# EAGLE design switch_board (EAGLE 7.4.0)
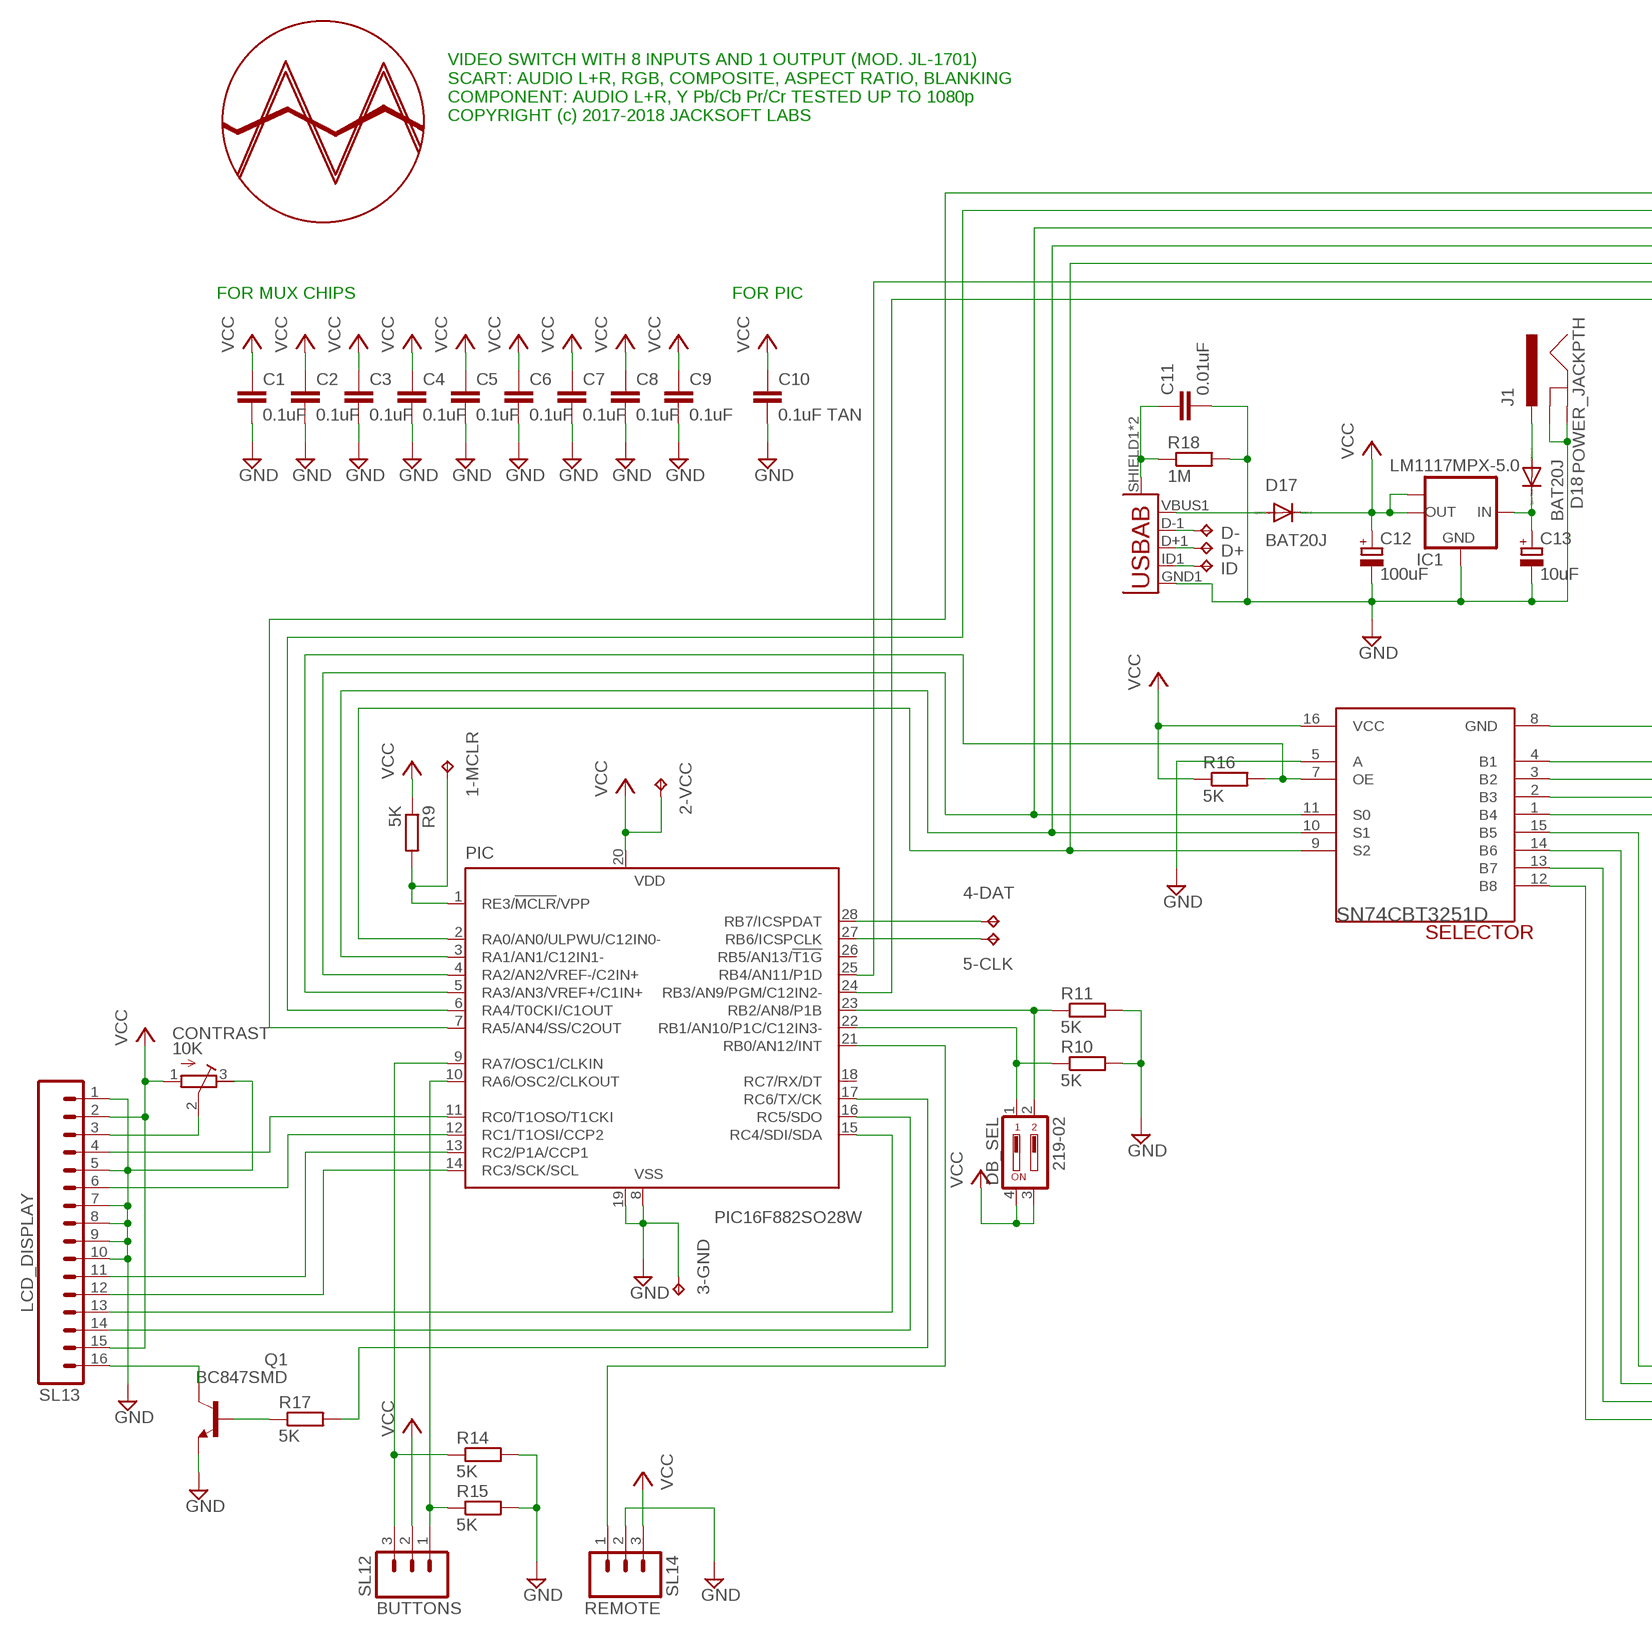
[diagram p0: schematic, sheet 1, part 1 of 2]
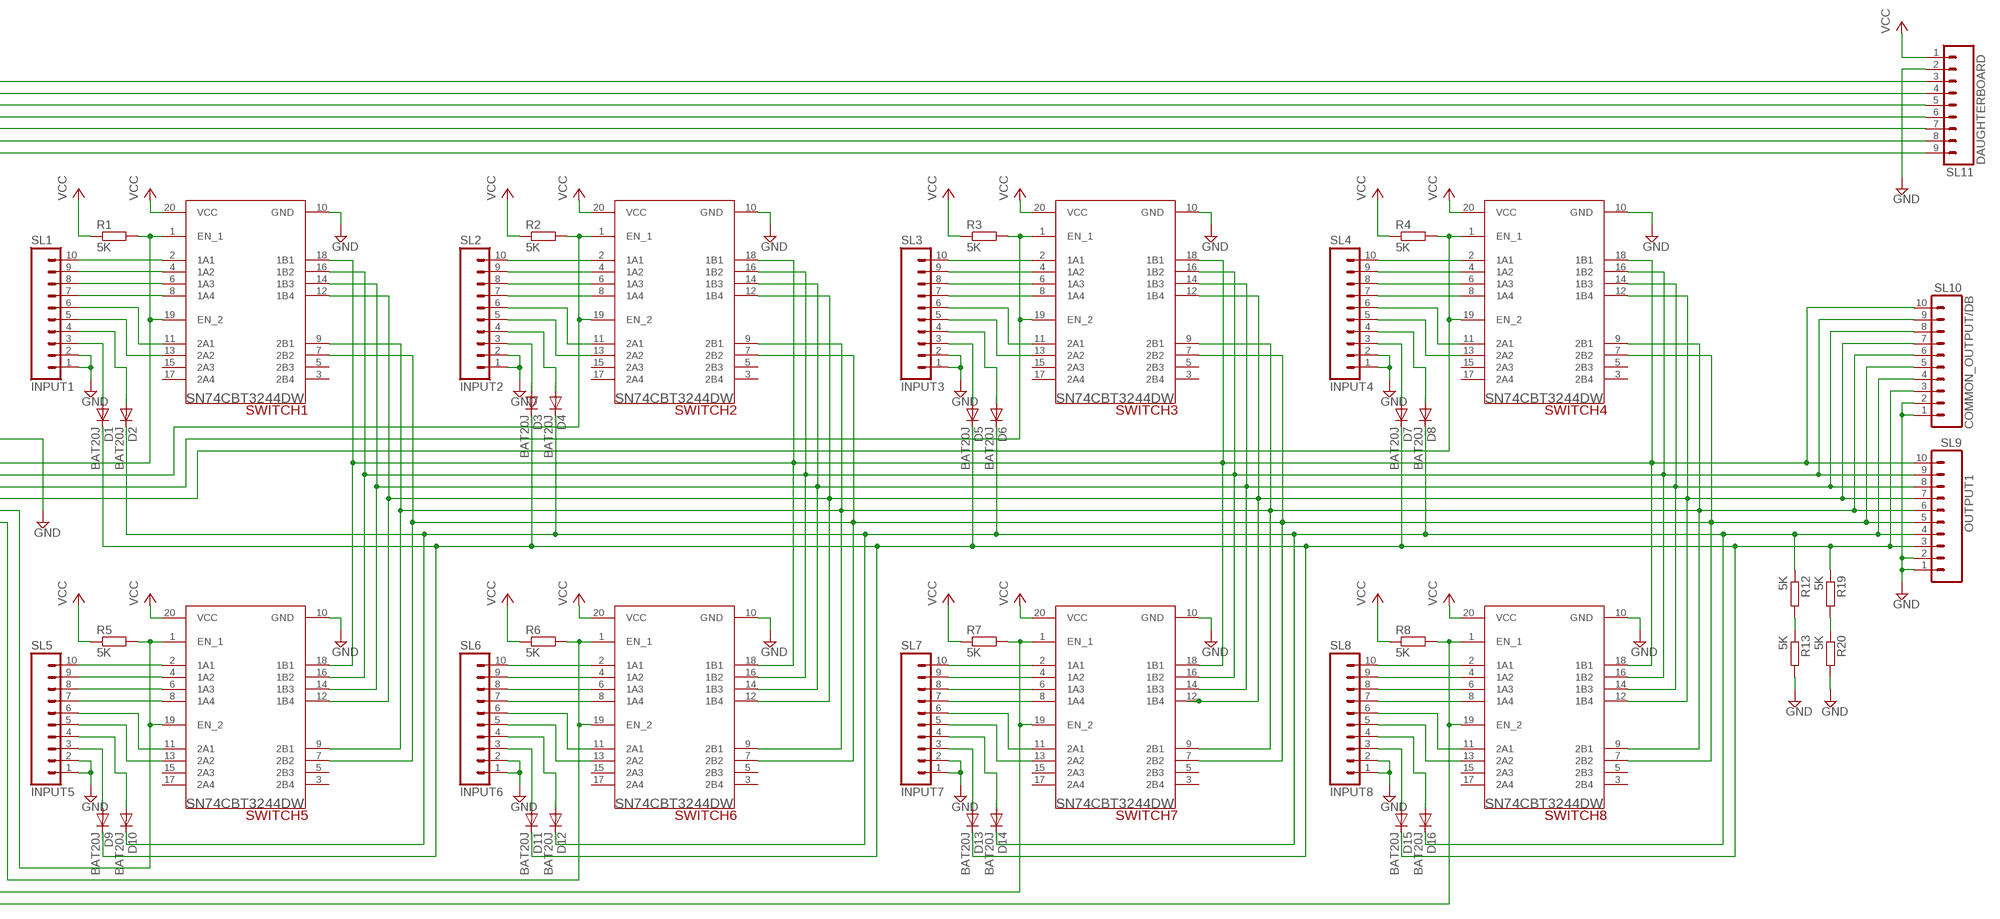
[diagram p1: schematic, sheet 1, part 2 of 2]

## Parts
1-MCLR  TPB1,27  [B1,27]
2-VCC  TPB1,27  [B1,27]
3-GND  TPB1,27  [B1,27]
4-DAT  TPB1,27  [B1,27]
5-CLK  TPB1,27  [B1,27]
C1  0.1uF  C-EUC0603  [C0603]
C2  0.1uF  C-EUC0603  [C0603]
C3  0.1uF  C-EUC0603  [C0603]
C4  0.1uF  C-EUC0603  [C0603]
C5  0.1uF  C-EUC0603  [C0603]
C6  0.1uF  C-EUC0603  [C0603]
C7  0.1uF  C-EUC0603  [C0603]
C8  0.1uF  C-EUC0603  [C0603]
C9  0.1uF  C-EUC0603  [C0603]
C10  0.1uF TAN  C-EUC3216  [C3216]
C11  0.01uF  C-EUC0603  [C0603]
C12  100uF  CPOL-EU153CLV-0405  [153CLV-0405]
C13  10uF  CPOL-EU153CLV-0405  [153CLV-0405]
CONTRAST  10K  R-TRIMM3304W  [RTRIM3304W]
D1  BAT20J  DIODE-SOD323-W  [SOD323-W]
D2  BAT20J  DIODE-SOD323-W  [SOD323-W]
D3  BAT20J  DIODE-SOD323-W  [SOD323-W]
D4  BAT20J  DIODE-SOD323-W  [SOD323-W]
D5  BAT20J  DIODE-SOD323-W  [SOD323-W]
D6  BAT20J  DIODE-SOD323-W  [SOD323-W]
D7  BAT20J  DIODE-SOD323-W  [SOD323-W]
D8  BAT20J  DIODE-SOD323-W  [SOD323-W]
D9  BAT20J  DIODE-SOD323-W  [SOD323-W]
D10  BAT20J  DIODE-SOD323-W  [SOD323-W]
D11  BAT20J  DIODE-SOD323-W  [SOD323-W]
D12  BAT20J  DIODE-SOD323-W  [SOD323-W]
D13  BAT20J  DIODE-SOD323-W  [SOD323-W]
D14  BAT20J  DIODE-SOD323-W  [SOD323-W]
D15  BAT20J  DIODE-SOD323-W  [SOD323-W]
D16  BAT20J  DIODE-SOD323-W  [SOD323-W]
D17  BAT20J  DIODE-SOD323-W  [SOD323-W]
D18  BAT20J  DIODE-SOD323-W  [SOD323-W]
D+  TPTP06R  [TP06R]
D-  TPTP06R  [TP06R]
DB_SEL  219-02  [CTS-219-02]
IC1  LM1117MPX-5.0  [SOT223]
ID  TPTP06R  [TP06R]
J1  POWER_JACKPTH  [POWER_JACK_PTH]
PIC  PIC16F882SO28W  [16F882]
Q1  BC847SMD  [SOT23]
R1  5K  R-EU_R0603  [R0603]
R2  5K  R-EU_R0603  [R0603]
R3  5K  R-EU_R0603  [R0603]
R4  5K  R-EU_R0603  [R0603]
R5  5K  R-EU_R0603  [R0603]
R6  5K  R-EU_R0603  [R0603]
R7  5K  R-EU_R0603  [R0603]
R8  5K  R-EU_R0603  [R0603]
R9  5K  R-EU_R0603  [R0603]
R10  5K  R-EU_R0603  [R0603]
R11  5K  R-EU_R0603  [R0603]
R12  5K  R-EU_R0603  [R0603]
R13  5K  R-EU_R0603  [R0603]
R14  5K  R-EU_R0603  [R0603]
R15  5K  R-EU_R0603  [R0603]
R16  5K  R-EU_R0603  [R0603]
R17  5K  R-EU_R0603  [R0603]
R18  1M  R-EU_R0603  [R0603]
R19  5K  R-EU_R0603  [R0603]
R20  5K  R-EU_R0603  [R0603]
SELECTOR  SN74CBT3251D  [SOIC127P1032X265-16N]
SL1  INPUT1  M10  [10P]
SL2  INPUT2  M10  [10P]
SL3  INPUT3  M10  [10P]
SL4  INPUT4  M10  [10P]
SL5  INPUT5  M10  [10P]
SL6  INPUT6  M10  [10P]
SL7  INPUT7  M10  [10P]
SL8  INPUT8  M10  [10P]
SL9  OUTPUT1  M10  [10P]
SL10  COMMON_OUTPUT/DB  M10  [10P]
SL11  DAUGHTERBOARD  M09  [09P]
SL12  BUTTONS  M03  [03P]
SL13  LCD_DISPLAY  M16  [16P]
SL14  REMOTE  M03  [03P]
SWITCH1  SN74CBT3244DW  [SOIC127P1032X265-20N]
SWITCH2  SN74CBT3244DW  [SOIC127P1032X265-20N]
SWITCH3  SN74CBT3244DW  [SOIC127P1032X265-20N]
SWITCH4  SN74CBT3244DW  [SOIC127P1032X265-20N]
SWITCH5  SN74CBT3244DW  [SOIC127P1032X265-20N]
SWITCH6  SN74CBT3244DW  [SOIC127P1032X265-20N]
SWITCH7  SN74CBT3244DW  [SOIC127P1032X265-20N]
SWITCH8  SN74CBT3244DW  [SOIC127P1032X265-20N]
U$1  JACKSOFTLABS-LOGOLONGTEXT  [LOGO-LONGTEXT]
USB  USB_POWER  MICROUSB""  [USB-MICRO-SMD]

## Nets
GND: 3-GND.TP C1.2 C2.2 C3.2 C4.2 C5.2 C6.2 C7.2 C8.2 C9.2 C10.2 C11.2 C12.- C13.- CONTRAST.3(E) IC1.1(GND) J1.GND J1.GNDBREAK PIC.8(VSS) PIC.19(VSS) Q1.2(E) R10.2 R11.2 R13.2 R14.2 R15.2 R18.2 R20.2 SELECTOR.5(A) SELECTOR.8(GND) SL1.1 SL1.2 SL2.1 SL2.2 SL3.1 SL3.2 SL4.1 SL4.2 SL5.1 SL5.2 SL6.1 SL6.2 SL7.1 SL7.2 SL8.1 SL8.2 SL9.1 SL9.2 SL10.1 SL10.2 SL11.2 SL13.1 SL13.5 SL13.7 SL13.8 SL13.9 SL13.10 SL14.2 SWITCH1.10(GND) SWITCH2.10(GND) SWITCH3.10(GND) SWITCH4.10(GND) SWITCH5.10(GND) SWITCH6.10(GND) SWITCH7.10(GND) SWITCH8.10(GND) USB.GND1(GND)
N$1: SL1.10 SWITCH1.2(1A1)
N$2: SL1.9 SWITCH1.4(1A2)
N$3: SL1.8 SWITCH1.6(1A3)
N$4: SL1.7 SWITCH1.8(1A4)
N$5: SL1.6 SWITCH1.11(2A1)
N$6: SL1.5 SWITCH1.13(2A2)
N$7: D2.A SL1.4
N$8: D1.A SL1.3
N$9: R1.2 SELECTOR.4(B1) SWITCH1.1(EN_1) SWITCH1.19(EN_2)
N$10: SL2.10 SWITCH2.2(1A1)
N$11: SL2.9 SWITCH2.4(1A2)
N$12: SL2.8 SWITCH2.6(1A3)
N$13: SL2.7 SWITCH2.8(1A4)
N$14: SL2.6 SWITCH2.11(2A1)
N$15: SL2.5 SWITCH2.13(2A2)
N$16: D4.A SL2.4
N$17: D3.A SL2.3
N$18: R2.2 SELECTOR.3(B2) SWITCH2.1(EN_1) SWITCH2.19(EN_2)
N$19: SL3.10 SWITCH3.2(1A1)
N$20: SL3.9 SWITCH3.4(1A2)
N$21: SL3.8 SWITCH3.6(1A3)
N$22: SL3.7 SWITCH3.8(1A4)
N$23: SL3.6 SWITCH3.11(2A1)
N$24: SL3.5 SWITCH3.13(2A2)
N$25: D6.A SL3.4
N$26: D5.A SL3.3
N$27: R3.2 SELECTOR.2(B3) SWITCH3.1(EN_1) SWITCH3.19(EN_2)
N$28: SL4.10 SWITCH4.2(1A1)
N$29: SL4.9 SWITCH4.4(1A2)
N$30: SL4.8 SWITCH4.6(1A3)
N$31: SL4.7 SWITCH4.8(1A4)
N$32: SL4.6 SWITCH4.11(2A1)
N$33: SL4.5 SWITCH4.13(2A2)
N$34: D8.A SL4.4
N$35: D7.A SL4.3
N$36: R4.2 SELECTOR.1(B4) SWITCH4.1(EN_1) SWITCH4.19(EN_2)
N$37: SL9.10 SL10.10 SWITCH1.18(1B1) SWITCH2.18(1B1) SWITCH3.18(1B1) SWITCH4.18(1B1) SWITCH5.18(1B1) SWITCH6.18(1B1) SWITCH7.18(1B1) SWITCH8.18(1B1)
N$38: SL9.9 SL10.9 SWITCH1.16(1B2) SWITCH2.16(1B2) SWITCH3.16(1B2) SWITCH4.16(1B2) SWITCH5.16(1B2) SWITCH6.16(1B2) SWITCH7.16(1B2) SWITCH8.16(1B2)
N$39: PIC.11(RC0/T1OSO/T1CKI) SL13.4
N$40: PIC.12(RC1/T1OSI/CCP2) SL13.6
N$41: PIC.13(RC2/P1A/CCP1) SL13.11
N$42: DB_SEL.1 PIC.22(RB1/AN10/P1C/C12IN3-) R10.1
N$43: PIC.14(RC3/SCK/SCL) SL13.12
N$44: CONTRAST.2(S) SL13.3
N$45: SL5.10 SWITCH5.2(1A1)
N$46: SL5.9 SWITCH5.4(1A2)
N$47: SL5.8 SWITCH5.6(1A3)
N$48: SL5.7 SWITCH5.8(1A4)
N$49: SL5.6 SWITCH5.11(2A1)
N$50: SL5.5 SWITCH5.13(2A2)
N$51: D10.A SL5.4
N$52: D9.A SL5.3
N$53: R5.2 SELECTOR.15(B5) SWITCH5.1(EN_1) SWITCH5.19(EN_2)
N$54: SL6.10 SWITCH6.2(1A1)
N$55: SL6.9 SWITCH6.4(1A2)
N$56: SL6.8 SWITCH6.6(1A3)
N$57: SL6.7 SWITCH6.8(1A4)
N$58: SL6.6 SWITCH6.11(2A1)
N$59: SL6.5 SWITCH6.13(2A2)
N$60: D12.A SL6.4
N$61: D11.A SL6.3
N$62: R6.2 SELECTOR.14(B6) SWITCH6.1(EN_1) SWITCH6.19(EN_2)
N$63: SL7.10 SWITCH7.2(1A1)
N$64: SL7.9 SWITCH7.4(1A2)
N$65: SL7.8 SWITCH7.6(1A3)
N$66: SL7.7 SWITCH7.8(1A4)
N$67: SL7.6 SWITCH7.11(2A1)
N$68: SL7.5 SWITCH7.13(2A2)
N$69: D14.A SL7.4
N$70: D13.A SL7.3
N$71: R7.2 SELECTOR.13(B7) SWITCH7.1(EN_1) SWITCH7.19(EN_2)
N$72: SL8.10 SWITCH8.2(1A1)
N$73: SL8.9 SWITCH8.4(1A2)
N$74: SL8.8 SWITCH8.6(1A3)
N$75: SL8.7 SWITCH8.8(1A4)
N$76: SL8.6 SWITCH8.11(2A1)
N$77: SL8.5 SWITCH8.13(2A2)
N$78: D16.A SL8.4
N$79: D15.A SL8.3
N$80: R8.2 SELECTOR.12(B8) SWITCH8.1(EN_1) SWITCH8.19(EN_2)
N$81: DB_SEL.2 PIC.23(RB2/AN8/P1B) R11.1
N$82: 1-MCLR.TP PIC.1(RE3/!MCLR!/VPP) R9.2
N$83: PIC.5(RA3/AN3/VREF+/C1IN+) R16.2 SELECTOR.7(OE)
N$84: C11.1 R18.1 USB.SHIELD1(SHIELD) USB.SHIELD2(SHIELD)
N$85: PIC.4(RA2/AN2/VREF-/C2IN+) SELECTOR.11(S0) SL11.5
N$86: PIC.3(RA1/AN1/C12IN1-) SELECTOR.10(S1) SL11.6
N$87: PIC.2(RA0/AN0/ULPWU/C12IN0-) SELECTOR.9(S2) SL11.7
N$88: PIC.6(RA4/T0CKI/C1OUT) SL11.4
N$89: 4-DAT.TP PIC.28(RB7/ICSPDAT)
N$90: 5-CLK.TP PIC.27(RB6/ICSPCLK)
N$91: PIC.7(RA5/AN4/SS/C2OUT) SL11.3
N$92: Q1.3(C) SL13.16
N$93: Q1.1(B) R17.1
N$94: D17.A USB.VBUS1(VBUS)
N$95: PIC.21(RB0/AN12/INT) SL14.1
N$96: PIC.15(RC4/SDI/SDA) SL13.13
N$97: PIC.16(RC5/SDO) SL13.14
N$98: PIC.17(RC6/TX/CK) R17.2
N$99: C13.+ D18.C IC1.3(IN)
N$100: PIC.10(RA6/OSC2/CLKOUT) R15.1 SL12.1
N$101: PIC.9(RA7/OSC1/CLKIN) R14.1 SL12.3
N$102: D1.C D3.C D5.C D7.C D9.C D11.C D13.C D15.C R19.1 SL9.3 SL10.3
N$103: D2.C D4.C D6.C D8.C D10.C D12.C D14.C D16.C R12.1 SL9.4 SL10.4
N$104: SL9.5 SL10.5 SWITCH1.7(2B2) SWITCH2.7(2B2) SWITCH3.7(2B2) SWITCH4.7(2B2) SWITCH5.7(2B2) SWITCH6.7(2B2) SWITCH7.7(2B2) SWITCH8.7(2B2)
N$105: SL9.6 SL10.6 SWITCH1.9(2B1) SWITCH2.9(2B1) SWITCH3.9(2B1) SWITCH4.9(2B1) SWITCH5.9(2B1) SWITCH6.9(2B1) SWITCH7.9(2B1) SWITCH8.9(2B1)
N$106: SL9.7 SL10.7 SWITCH1.12(1B4) SWITCH2.12(1B4) SWITCH3.12(1B4) SWITCH4.12(1B4) SWITCH5.12(1B4) SWITCH6.12(1B4) SWITCH7.12(1B4) SWITCH8.12(1B4)
N$107: SL9.8 SL10.8 SWITCH1.14(1B3) SWITCH2.14(1B3) SWITCH3.14(1B3) SWITCH4.14(1B3) SWITCH5.14(1B3) SWITCH6.14(1B3) SWITCH7.14(1B3) SWITCH8.14(1B3)
N$108: D18.A J1.PWR
N$109: D-.TP USB.D-1(D-)
N$110: D+.TP USB.D+1(D+)
N$111: ID.TP USB.ID1(USBID)
N$112: R12.2 R13.1
N$113: R19.2 R20.1
N$116: PIC.25(RB4/AN11/P1D) SL11.8
N$117: PIC.24(RB3/AN9/PGM/C12IN2-) SL11.9
VCC: 2-VCC.TP C1.1 C2.1 C3.1 C4.1 C5.1 C6.1 C7.1 C8.1 C9.1 C10.1 C12.+ CONTRAST.1(A) D17.C DB_SEL.3 DB_SEL.4 IC1.2(OUT) IC1.TAB(OUT1) PIC.20(VDD) R1.1 R2.1 R3.1 R4.1 R5.1 R6.1 R7.1 R8.1 R9.1 R16.1 SELECTOR.16(VCC) SL11.1 SL12.2 SL13.2 SL13.15 SL14.3 SWITCH1.20(VCC) SWITCH2.20(VCC) SWITCH3.20(VCC) SWITCH4.20(VCC) SWITCH5.20(VCC) SWITCH6.20(VCC) SWITCH7.20(VCC) SWITCH8.20(VCC)
Unconnected: PIC.18(RC7/RX/DT) PIC.26(RB5/AN13/!T1G) SWITCH1.3(2B4) SWITCH1.5(2B3) SWITCH1.15(2A3) SWITCH1.17(2A4) SWITCH2.3(2B4) SWITCH2.5(2B3) SWITCH2.15(2A3) SWITCH2.17(2A4) SWITCH3.3(2B4) SWITCH3.5(2B3) SWITCH3.15(2A3) SWITCH3.17(2A4) SWITCH4.3(2B4) SWITCH4.5(2B3) SWITCH4.15(2A3) SWITCH4.17(2A4) SWITCH5.3(2B4) SWITCH5.5(2B3) SWITCH5.15(2A3) SWITCH5.17(2A4) SWITCH6.3(2B4) SWITCH6.5(2B3) SWITCH6.15(2A3) SWITCH6.17(2A4) SWITCH7.3(2B4) SWITCH7.5(2B3) SWITCH7.15(2A3) SWITCH7.17(2A4) SWITCH8.3(2B4) SWITCH8.5(2B3) SWITCH8.15(2A3) SWITCH8.17(2A4)

## Notes on the sheet
- VIDEO SWITCH WITH 8 INPUTS AND 1 OUTPUT (MOD. JL-1701)
  SCART: AUDIO L+R, RGB, COMPOSITE, ASPECT RATIO, BLANKING
  COMPONENT: AUDIO L+R, Y Pb/Cb Pr/Cr TESTED UP TO 1080p
  COPYRIGHT (c) 2017-2018 JACKSOFT LABS
- FOR MUX CHIPS | FOR PIC

## Library data of the parts
1-MCLR 2-VCC 3-GND 4-DAT 5-CLK D+ D- ID = testpad:TP: Test pad
C1-C11 = resistor:C-EU: CAPACITOR, European symbol
C12 C13 = resistor:CPOL-EU: POLARIZED CAPACITOR, European symbol
CONTRAST = resistor:R-TRIMM: Trimm resistor
D1-D18 = diode:DIODE-: DIODE
DB_SEL = switch-dil:219-02*: Surface Mount DIP Switch Series 219 SMT CTS Electronic Components Sourc: www.ctscorp.com; OC_FARNELL: unknown; OC_NEWARK: unknown
IC1 = lm1117:LM1117MPX-*
J1 = SparkFun-Connectors:POWER_JACK: Power Jack This is the standard 5.5mm barrel jack for power. The PTH is the most common, proven, reliable, footprint. The Slot footprint only works if the mill layer is transmitted to the PCB fab house so be warned. Mating wall wart : TOL-00298 (and others); PROD_ID: CONN-08197
PIC = PIC16F882:PIC16F882: PIC16F882
Q1 = transistor-npn:BC847*: NPN Transistor
R1-R20 = resistor:R-EU_: RESISTOR, European symbol
SELECTOR = brendan-stuff-mod:SN74CBT3251D: SN74CBT3251D 1-of-8 FET Multiplexer and Demultiplexer, SOIC16 package.
SL1-SL10 = con-amp-quick:M10: AMP QUICK CONNECTOR; OC_FARNELL: unknown; OC_NEWARK: unknown
SL11 = con-amp-quick:M09: AMP QUICK CONNECTOR; OC_FARNELL: unknown; OC_NEWARK: unknown
SL12 SL14 = con-amp-quick:M03: AMP QUICK CONNECTOR; OC_FARNELL: unknown; OC_NEWARK: unknown
SL13 = con-amp-quick:M16: AMP QUICK CONNECTOR; OC_FARNELL: unknown; OC_NEWARK: unknown
SWITCH1-SWITCH8 = brendan-stuff:SN74CBT3244DW: SN74CBT3244DW Octal FET bus switch, SOIC20 package.
U$1 = jl-logo:JACKSOFTLABS-LOGO: Jacksoft Labs logo (Text Place)
USB = microusbok:MICROUSB: This is a USB AB connector that is compatible with USB OTG. i.e. this connector can serve as a host or device

## Board
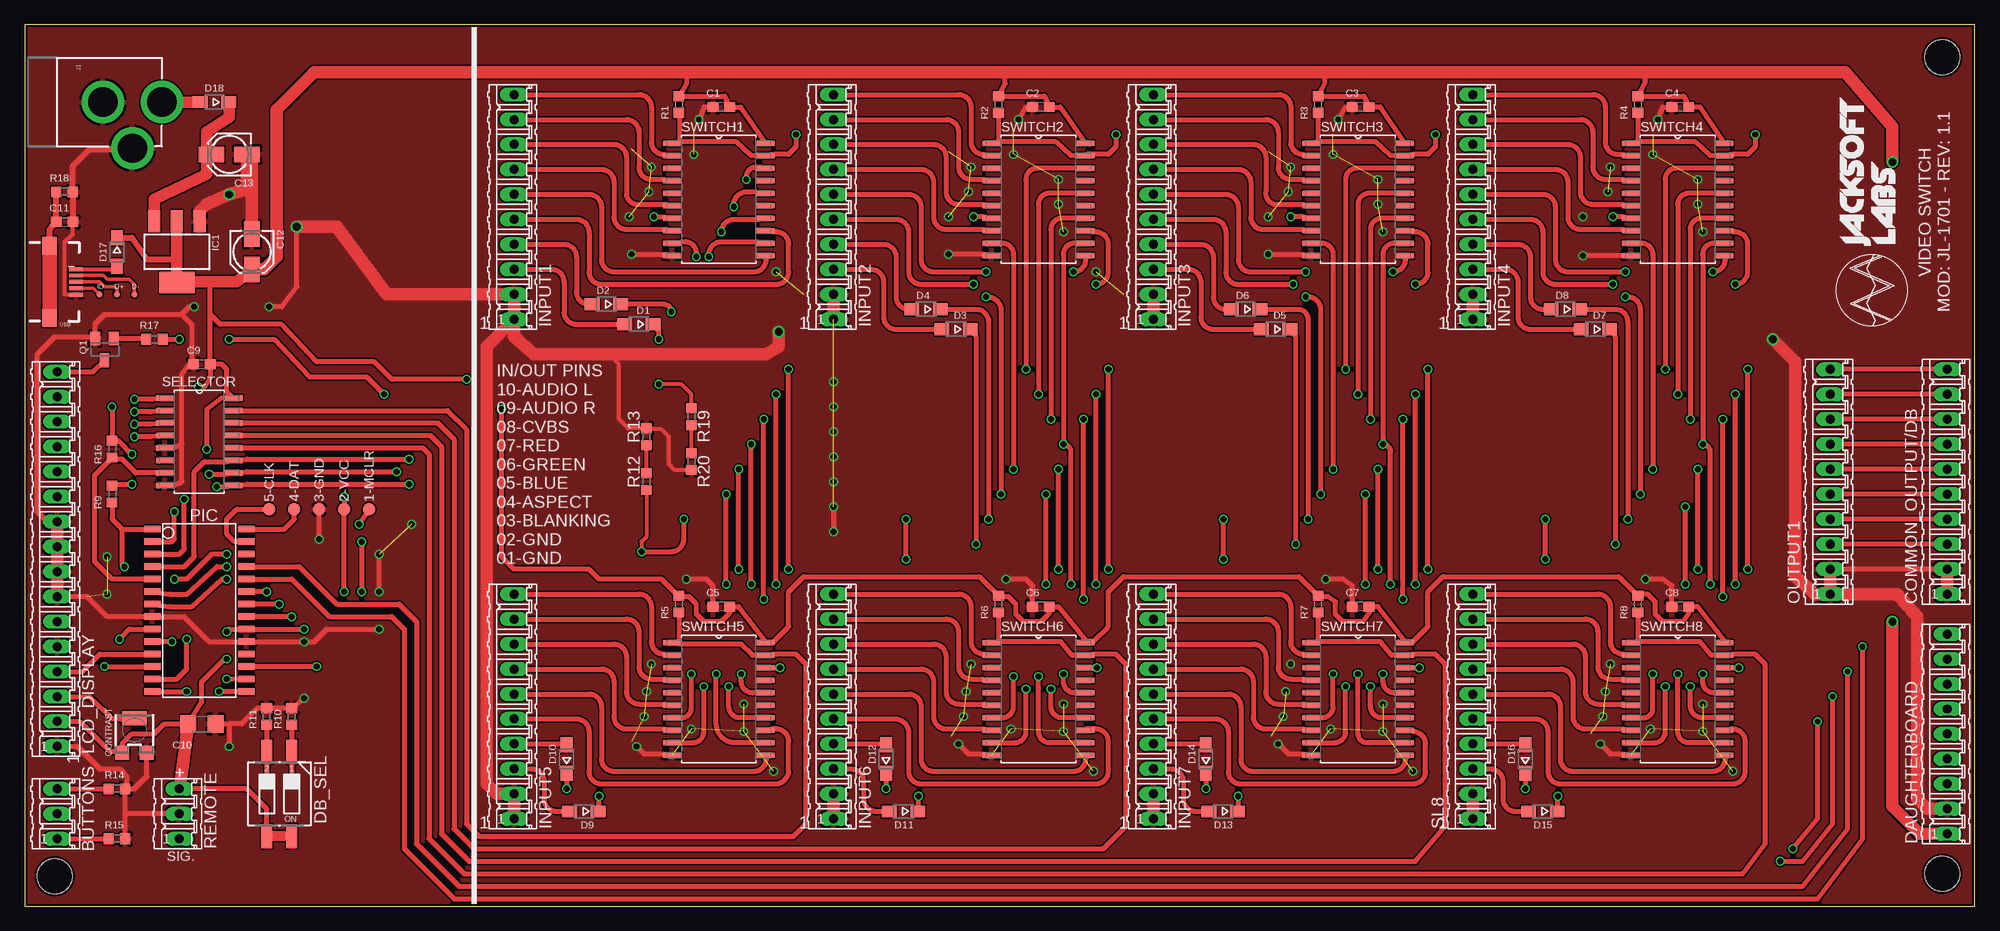
[diagram p2: board, top side]
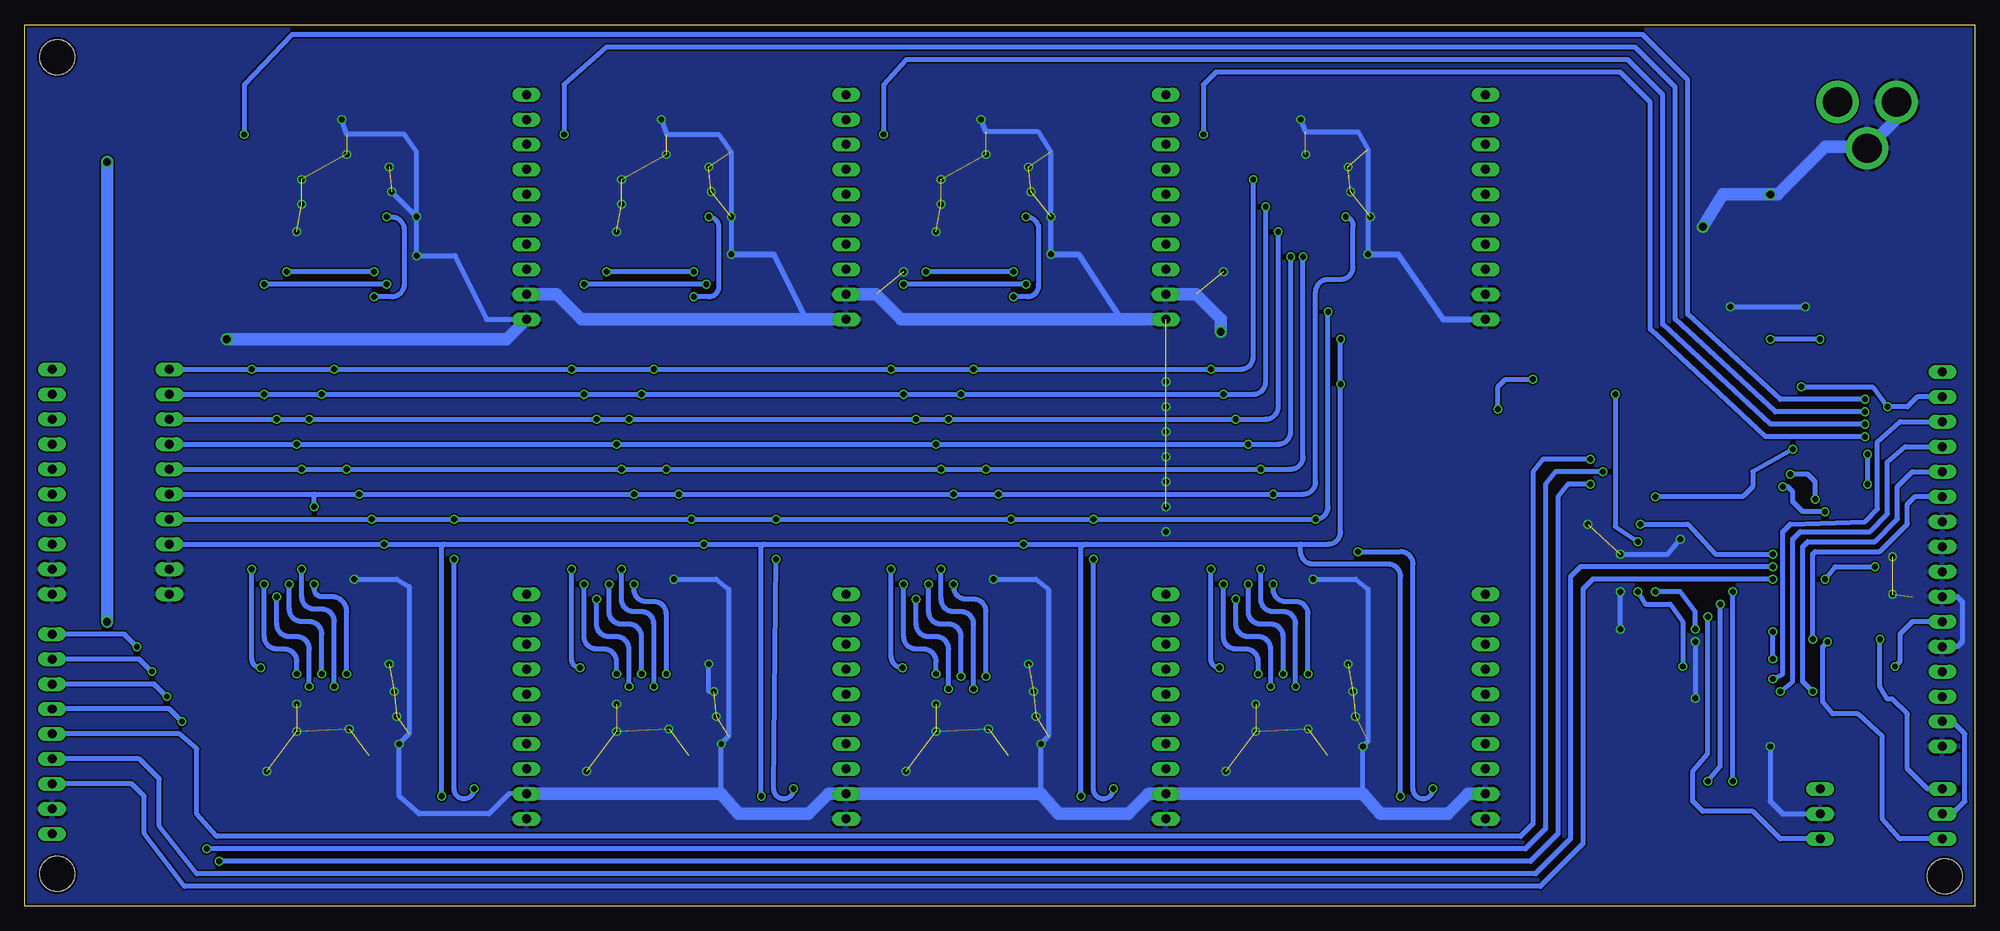
[diagram p3: board, bottom side, seen from below]

Size 198.37 x 89.66 mm. Coordinates in mm from the lower left corner, seen from the top.
Outline: 0,0 198.37,0 198.37,89.66 0,89.66 0,0
Copper layers (1*16): Top 0.035mm / dielectric 1.5mm / Bottom 0.035mm
Design rules "ITead_DRC": minimum track width 6mil, minimum drill 12mil, track to track 6mil, track to pad 6mil, pad to pad 6mil, via to via 6mil, smd to smd 0mil, copper to edge 10mil, drill to drill 10mil, minimum pad ring 10mil, minimum via ring 6mil, stop-mask expansion 2mil, vias tented up to drill 100mil, thermal gap 10mil
Holes 3.56 mm at 3.05,3.05 195.07,3.3 195.07,86.36

### Footprints (pad centres in the part's own frame; a part is rotated, then mirrored left to right if it is on the bottom)
B1,27 = smd 1.27 x 1.27: TP 0,0
C0603 = smd 1.1 x 1: 1 -0.85,0; 2 0.85,0
C3216 = smd 1.6 x 1.8: 1 -1.4,0; 2 1.4,0
153CLV-0405 = smd 2.6 x 1.6: + 1.8,0; - -1.8,0
RTRIM3304W = smd 1.4 x 1.4: 1 -1.25,-1.9; 3 1.25,-1.9 | smd 2.5 x 1.4: 2 0,1.6
SOD323-W = smd 1.5 x 1.2: A 1.45,0; C -1.45,0
TP06R = smd 0.6 x 0.6: TP 0,0
CTS-219-02 = smd 1.13 x 2.44: 1 -1.27,-4.3; 2 1.27,-4.3; 3 1.27,4.3; 4 -1.27,4.3
SOT223 = smd 1.219 x 2.235: 1 -2.311,-3.099; 2 0,-3.099; 3 2.311,-3.099 | smd 3.6 x 2.2: TAB 0,3.099
POWER_JACK_PTH = drill 2.997 pad 4.318: GND 0,7.7; GNDBREAK 4.7,10.7; PWR 0,13.7
16F882 = smd 0.65 x 1.7: 1 -8.89,-4.78; 2 -7.62,-4.78; 3 -6.35,-4.78; 4 -5.08,-4.78; 5 -3.81,-4.78; 6 -2.54,-4.78; 7 -1.27,-4.78; 8 0,-4.78; 9 1.27,-4.78; 10 2.54,-4.78; 11 3.81,-4.78; 12 5.08,-4.78; 13 6.35,-4.78; 14 7.62,-4.78; 15 7.62,4.78; 16 6.35,4.78; 17 5.08,4.78; 18 3.81,4.78; 19 2.54,4.78; 20 1.27,4.78; 21 0,4.78; 22 -1.27,4.78; 23 -2.54,4.78; 24 -3.81,4.78; 25 -5.08,4.78; 26 -6.35,4.78; 27 -7.62,4.78; 28 -8.89,4.78
SOT23 = smd 1 x 1.4: 1 -0.95,-1.1; 2 0.95,-1.1; 3 0,1.1
R0603 = smd 1 x 1.1: 1 -0.85,0; 2 0.85,0
SOIC127P1032X265-16N = smd 1.803 x 0.533: 1 -3.505,4.445; 2 -3.505,3.175; 3 -3.505,1.905; 4 -3.505,0.635; 5 -3.505,-0.635; 6 -3.505,-1.905; 7 -3.505,-3.175; 8 -3.505,-4.445; 9 3.505,-4.445; 10 3.505,-3.175; 11 3.505,-1.905; 12 3.505,-0.635; 13 3.505,0.635; 14 3.505,1.905; 15 3.505,3.175; 16 3.505,4.445
10P = drill 0.914 long: 1 -11.43,0; 2 -8.89,0; 3 -6.35,0; 4 -3.81,0; 5 -1.27,0; 6 1.27,0; 7 3.81,0; 8 6.35,0; 9 8.89,0; 10 11.43,0
09P = drill 0.914 long: 1 -10.16,0; 2 -7.62,0; 3 -5.08,0; 4 -2.54,0; 5 0,0; 6 2.54,0; 7 5.08,0; 8 7.62,0; 9 10.16,0
03P = drill 0.914 long: 1 -2.54,0; 2 0,0; 3 2.54,0
16P = drill 0.914 long: 1 -19.05,0; 2 -16.51,0; 3 -13.97,0; 4 -11.43,0; 5 -8.89,0; 6 -6.35,0; 7 -3.81,0; 8 -1.27,0; 9 1.27,0; 10 3.81,0; 11 6.35,0; 12 8.89,0; 13 11.43,0; 14 13.97,0; 15 16.51,0; 16 19.05,0
SOIC127P1032X265-20N = smd 1.803 x 0.533: 1 -4.775,5.715; 2 -4.775,4.445; 3 -4.775,3.175; 4 -4.775,1.905; 5 -4.775,0.635; 6 -4.775,-0.635; 7 -4.775,-1.905; 8 -4.775,-3.175; 9 -4.775,-4.445; 10 -4.775,-5.715; 11 4.775,-5.715; 12 4.775,-4.445; 13 4.775,-3.175; 14 4.775,-1.905; 15 4.775,-0.635; 16 4.775,0.635; 17 4.775,1.905; 18 4.775,3.175; 19 4.775,4.445; 20 4.775,5.715
USB-MICRO-SMD = smd 1.4 x 0.4: D+1 2.7,0; D-1 2.7,0.65; GND1 2.7,-1.3; ID1 2.7,-0.65; VBUS1 2.7,1.3 | smd 1.499 x 1.803: SHIELD1 0,3.683; SHIELD2 0,-3.683

### Placement (x,y rotation side)
1-MCLR  35.05,40.39 90 top
2-VCC  32.51,40.39 90 top
3-GND  29.97,40.39 0 top
4-DAT  27.43,40.39 0 top
5-CLK  24.89,40.39 0 top
C1  70.87,81.28 180 top
C2  103.38,81.28 180 top
C3  135.89,81.28 180 top
C4  168.4,81.28 180 top
C5  70.87,30.48 180 top
C6  103.38,30.48 180 top
C7  135.89,30.48 180 top
C8  168.4,30.48 180 top
C9  18.03,55.12 180 top
C10  18.03,18.54 0 top
C11  4.06,69.6 0 top
C12  23.11,66.55 270 top
C13  20.83,76.45 180 top
CONTRAST  11.18,17.53 0 top
D1  62.48,59.18 180 top
D2  59.18,61.21 180 top
D3  94.74,58.67 180 top
D4  91.69,60.71 180 top
D5  127.25,58.67 180 top
D6  124.21,60.71 180 top
D7  159.77,58.67 180 top
D8  156.72,60.71 180 top
D9  56.9,9.65 180 top
D10  55.12,14.99 90 top
D11  89.41,9.65 180 top
D12  87.63,14.99 90 top
D13  121.92,9.65 180 top
D14  120.14,14.99 90 top
D15  154.43,9.65 180 top
D16  152.65,14.99 90 top
D17  9.4,66.55 270 top
D18  19.3,81.79 180 top
D+  9.4,62.23 0 top
D-  11.18,62.23 0 top
DB_SEL  25.91,11.43 180 top
IC1  15.49,66.55 180 top
ID  7.62,62.23 0 top
J1  0.25,81.79 270 top
PIC  17.78,29.46 270 top
Q1  8.13,56.64 180 top
R1  66.55,81.53 270 top
R2  99.06,81.53 270 top
R3  131.57,81.53 270 top
R4  164.08,81.53 270 top
R5  66.55,30.73 270 top
R6  99.06,30.73 270 top
R7  131.57,30.73 270 top
R8  164.08,30.73 270 top
R9  8.89,41.91 270 top
R10  27.18,19.3 90 top
R11  24.64,19.3 90 top
R12  63.25,43.18 90 top
R13  63.25,47.75 90 top
R14  9.4,11.94 0 top
R15  9.4,6.86 0 top
R16  8.89,46.48 270 top
R17  13.21,57.66 0 top
R18  4.06,72.64 0 top
R19  67.82,49.78 270 top
R20  67.82,45.21 270 top
SELECTOR  17.78,47.24 0 top
SL1  49.78,71.12 90 top
SL2  82.3,71.12 90 top
SL3  114.81,71.12 90 top
SL4  147.32,71.12 90 top
SL5  49.78,20.32 90 top
SL6  82.3,20.32 90 top
SL7  114.81,20.32 90 top
SL8  147.32,20.32 90 top
SL9  183.64,43.18 90 top
SL10  195.58,43.18 90 top
SL11  195.58,17.53 90 top
SL12  3.3,9.4 90 top
SL13  3.3,35.31 90 top
SL14  15.75,9.4 90 top
SWITCH1  70.61,71.88 0 top
SWITCH2  103.12,71.88 0 top
SWITCH3  135.64,71.88 0 top
SWITCH4  168.15,71.88 0 top
SWITCH5  70.61,21.08 0 top
SWITCH6  103.12,21.08 0 top
SWITCH7  135.64,21.08 0 top
SWITCH8  168.15,21.08 0 top
U$1  187.71,62.23 90 top
USB  2.54,63.5 0 top

### Tracks (layer width: path | path; a pad name or v marks a point on that pad's centre or on a via)
GND  (via drill 0.6, 0.8)  (61 unrouted)
  Top 0.406: USB.GND1 4.06,62.2 4.06,67.56 4.91,68.33 C11.2 | R20.2 66.13,44.36 65.53,44.96 65.53,47.75 64.77,48.51 63.33,48.51 R13.2 61.38,48.6 60.45,49.53 60.45,55.12 59.44,56.13
  Top 0.508: SL10.2 SL9.2 | C1.2 69.09,81.28 v68.58,80.01 | v61.72,66.29 65.33,66.29 SWITCH1.10 | SWITCH2.10 98.3,66.17 97.54,66.29 v93.98,66.29 | v101.09,80.01 101.85,81.28 C2.2 | C3.2 134.37,81.28 v133.6,80.01 | v126.49,66.29 130.1,66.29 SWITCH3.10 | SWITCH4.10 v158.5,66.17 | v166.12,80.01 166.62,81.28 C4.2 | R15.2 10.25,9.4 | 10.25,9.4 R14.2 | SL13.1 5.33,16.26 7.62,13.97 9.65,13.97 10.41,13.21 10.41,12.1 R14.2 | R14.2 11.18,11.94 12.45,13.21 12.45,15.61 CONTRAST.3 | SL13.7 6.35,31.5 8.38,29.46 PIC.8 16.26,29.46 18.8,26.92 PIC.19 v28.45,26.92 29.46,26.92 30.73,28.19 v36.07,28.19 | SELECTOR.5 15.11,46.61 16,46.99 | 16,46.99 16,54.1 16.76,55.12 C9.2 17.02,55.21 17.02,59.18 16,60.2 | SL14.2 10.25,9.4 | 20.83,18.54 22.1,18.54 23.71,20.15 R11.2 R10.2 v28.45,21.17 | C10.2 20.83,18.54 | 20.83,18.54 v20.83,16.26 | 16,60.2 8.13,60.2 7.18,59.25 Q1.2 7.01,57.91 3.05,57.91 1.27,56.13 1.27,40.13 2.29,39.12 SL13.10 | SELECTOR.8 15.11,42.8 16,43.18 16,46.99 | C5.2 70.02,32.6 69.34,33.27 v67.31,33.27 | v62.23,16.26 62.99,15.49 64.95,15.49 SWITCH5.10 | C6.2 102.53,32.6 101.85,33.27 v99.82,33.27 | v95,16.51 96.01,15.49 97.46,15.49 SWITCH6.10 | C7.2 135.04,32.6 134.11,33.27 v132.33,33.27 | v127.51,16.51 128.52,15.49 129.97,15.49 SWITCH7.10 | C8.2 167.55,32.6 166.62,33.27 v164.85,33.27 | v160.27,16.51 161.29,15.49 162.48,15.49 SWITCH8.10 | v27.69,69.09 27.69,62.99 26.16,60.96 v24.89,60.96 | v17.27,60.96 16.76,60.96 16,60.2 | v36.07,32 v36.07,35.81 | v29.97,37.34 3-GND.TP | v82.3,40.64 v82.3,38.1
  Top 0.635: C11.2 R18.2 4.91,75.27 6.6,76.96 10.83,76.96 J1.GNDBREAK
  Top 1.27: SL1.1 SL1.2 36.83,62.23 31.75,69.09 v27.69,69.09 | SL10.1 SL10.2 | SL9.2 SL9.1 | SL2.2 SL2.1 | SL3.2 SL3.1 | SL4.2 SL4.1 | SL5.1 SL5.2 48.01,11.43 46.99,12.45 46.99,56.9 SL1.1 | SL6.2 SL6.1 | SL7.2 SL7.1 | SL8.2 SL8.1 | IC1.1 17.78,70.43 17.78,70.61 18.54,71.37 v20.83,72.39 22.63,72.92 C13.- 23.11,75.97 C12.- | v76.71,58.42 76.71,56.9 75.44,56.13 59.44,56.13 51.82,56.13 49.78,57.91 SL1.1 | SL13.7 SL13.8 SL13.9 SL13.10 | SL9.1 182.12,31.75 180.09,33.53 180.09,55.37 v177.8,57.66 | SL11.2 193.55,9.91 192.53,10.92 192.53,29.46 190.5,31.75 SL9.1
  Bottom 0.508: v68.58,80.01 68.07,78.74 62.74,78.74 61.72,76.96 v61.72,66.29 | v93.98,66.29 93.98,76.71 95.25,78.74 100.58,78.74 v101.09,80.01 | v133.6,80.01 133.1,78.49 127.76,78.49 126.49,76.71 v126.49,66.29 | v158.5,70.1 v158.5,66.17 154.56,66.17 151.38,59.69 SL4.1 | v158.5,70.1 158.5,76.71 159.77,78.49 165.61,78.49 v166.12,80.01 | SL13.7 1.78,31.5 1.27,30.99 1.27,26.92 1.78,26.42 SL13.5 | v20.83,16.26 20.83,10.67 19.56,9.4 SL14.2 | v67.31,33.27 62.99,33.27 61.72,32.26 61.72,16.76 v62.23,16.26 62.23,11.68 | v99.82,33.27 95.5,33.27 94.23,32.26 94.23,17.27 v95,16.51 95,11.43 | v132.33,33.27 128.02,33.27 126.75,32.26 126.75,17.27 v127.51,16.51 127.51,11.43 | v164.85,33.27 160.53,33.27 159.26,32.51 159.26,17.53 v160.27,16.51 160.27,11.18 158.24,9.4 151.13,9.4 149.1,11.43 SL8.2 | 62.23,11.43 62.23,11.68 | 62.48,11.43 62.23,11.68 | v24.89,60.96 v17.27,60.96 | v28.45,26.92 v28.45,21.17 | v36.07,28.19 v36.07,32 | v36.07,35.81 31.24,35.81 v29.97,37.34 | 11.08,77.22 J1.GNDBREAK | v128.27,21.84 128.78,21.84 v128.78,24.64 | v158.5,70.1 v161.04,72.64
  Bottom 0.635: v126.49,66.29 122.17,66.29 118.87,59.69 | v93.98,66.29 91.19,66.29 86.87,59.69 | v61.72,66.29 58.67,66.29 54.1,59.69 SL1.1
  Bottom 1.27: SL3.1 118.87,59.69 141.73,59.69 144.27,62.23 SL4.2 | SL2.1 86.87,59.69 109.22,59.69 111.76,62.23 SL3.2 | SL2.2 79.25,62.23 76.71,59.69 v76.71,58.42 | v27.69,69.09 25.65,72.39 v20.83,72.39 20.07,72.39 15.24,77.22 11.08,77.22 | SL8.2 127.51,11.43 125.73,9.4 118.62,9.4 116.59,11.43 SL7.2 95,11.43 93.22,9.4 86.11,9.4 84.07,11.43 SL6.2 62.48,11.43 | SL5.2 51.56,11.43 53.59,9.4 60.45,9.4 62.23,11.43 | v177.8,57.66 149.35,57.66 SL4.1 | J1.GND 7.95,80.09 J1.GNDBREAK
  other vias: 82.3,53.34 82.3,50.8 82.3,48.26 82.3,45.72 82.3,43.18 39.37,38.86 173.74,13.72 170.69,17.78 170.69,20.57 165.35,18.03 160.53,19.3 160.78,21.84 161.29,24.64 141.22,13.72 138.18,17.78 138.18,20.57 132.84,18.03 128.02,19.3 108.71,13.72 105.66,17.78 105.66,20.57 100.33,18.03 95.5,19.3 95.76,21.84 96.27,24.64 76.2,13.72 73.15,17.78 73.15,20.57 67.82,18.03 62.99,19.3 63.25,21.84 63.75,24.64 68.07,76.45 63.75,75.18 63.5,72.64 61.47,70.1 76.45,64.52 96.27,75.18 96.01,72.64 100.58,76.45 108.97,64.52 133.1,76.45 128.78,75.18 128.52,72.64 165.61,76.45 161.29,75.18 95.5,19.3 105.66,20.57 105.66,17.78 100.33,18.03 95.76,21.84 96.27,24.64 108.71,13.72 170.69,20.57 170.69,17.78 165.35,18.03 165.35,18.03 170.69,20.57 170.69,17.78 173.74,13.72 173.74,13.72 160.53,19.3 160.53,19.3 160.78,21.84 160.78,21.84 161.29,24.64 161.29,24.64 141.22,13.72 141.22,13.72 138.18,17.78 138.18,17.78 138.18,20.57 138.18,20.57 132.84,18.03 132.84,18.03 128.02,19.3 128.02,19.3 105.16,73.91 105.16,71.37 137.67,73.91 137.67,71.37 170.18,73.91 170.18,71.37 105.66,68.58 138.18,68.58 170.69,68.58 8.38,35.56 8.38,31.75 93.98,70.1 126.49,70.1
  pour Bottom: 0.25,89.41 198.12,89.41 198.12,0.25 0.25,0.25
  pour Top: 0.25,0.25 0.25,89.41 198.12,89.41 198.12,0.25
N$1
  Top 0.508: SL1.10 62.48,82.55 arc-90 63.75,81.28 63.75,77.72 arc90 65.02,76.45 65.08,76.45 SWITCH1.2
N$2
  Top 0.508: SL1.9 61.21,80.01 arc-90 62.48,78.74 62.48,75.18 arc90 63.75,73.91 65.08,73.91 SWITCH1.4
N$3
  Top 0.508: SL1.8 59.94,77.47 arc-90 61.21,76.2 61.21,72.39 arc90 62.48,71.37 65.33,71.37 SWITCH1.6
N$4
  Top 0.508: SL1.7 58.67,74.93 arc-90 59.94,73.66 59.94,70.1 arc90 61.21,68.83 65.33,68.83 SWITCH1.8
N$5
  Top 0.508: SL1.6 57.4,72.39 arc-90 58.67,71.12 58.67,65.79 arc90 59.94,64.52 74.17,64.52 arc90 75.44,65.79 75.44,66.12 arc90 SWITCH1.11
N$6
  Top 0.508: SL1.5 56.13,69.85 arc-90 57.4,68.58 57.4,64.52 arc90 58.67,63.25 76.45,63.25 arc90 77.72,64.52 77.72,67.31 arc90 76.45,68.58 76.2,68.58 75.44,68.71 SWITCH1.13
N$7
  Top 0.508: SL1.4 54.86,67.31 arc-90 56.13,66.04 56.13,62.48 arc90 57.4,61.21 D2.A
N$8
  Top 0.508: SL1.3 53.59,64.77 arc-90 54.86,63.5 54.86,60.45 arc90 56.13,59.18 D1.A
N$9  (via drill 0.6)
  Top 0.508: 66.6,77.72 72.39,77.72 73.91,76.33 SWITCH1.19 76.28,76.45 77.72,76.45 78.49,77.22 v78.49,78.49 | 66.6,77.72 SWITCH1.1 | R1.2 66.6,80.68 66.6,77.72 | SELECTOR.4 12.88,47.75 v11.18,47.75
  Bottom 0.508: v11.18,47.75 21.34,47.75 33.02,58.67 33.02,81.79 36.07,84.84 77.22,84.84 78.49,83.57 v78.49,78.49
N$10
  Top 0.508: SL2.10 95,82.55 arc-90 96.27,81.28 96.27,77.72 arc90 97.54,76.45 97.59,76.45 SWITCH2.2
N$11
  Top 0.508: SL2.9 93.73,80.01 arc-90 95,78.74 95,75.18 arc90 96.27,73.91 97.59,73.91 SWITCH2.4
N$12
  Top 0.508: SL2.8 92.46,77.47 arc-90 93.73,76.2 93.73,72.64 arc90 95,71.37 97.59,71.37 SWITCH2.6
N$13
  Top 0.508: SL2.7 91.19,74.93 arc-90 92.46,73.66 92.46,70.1 arc90 93.73,68.83 97.59,68.83 SWITCH2.8
N$14  (via drill 0.6)
  Top 0.508: SL2.6 89.92,72.39 arc-90 91.19,71.12 91.19,65.79 arc90 92.46,64.52 v97.79,64.52 | v106.68,64.52 arc90 107.95,65.79 107.95,66.12 arc90 SWITCH2.11
  Bottom 0.508: v97.79,64.52 v106.68,64.52
N$15  (via drill 0.6)
  Top 0.508: SL2.5 88.65,69.85 arc-90 89.92,68.58 89.92,64.52 arc90 91.19,63.25 v96.52,63.25 | v108.97,63.25 arc90 110.24,64.52 110.24,67.31 arc90 108.97,68.58 108.66,68.58 SWITCH2.13
  Bottom 0.508: v96.52,63.25 v108.97,63.25
N$16
  Top 0.508: SL2.4 87.38,67.31 arc-90 88.65,66.04 88.65,61.98 arc90 89.92,60.71 D4.A
N$17
  Top 0.508: SL2.3 86.11,64.77 arc-90 87.38,63.5 87.38,59.94 arc90 88.65,58.67 D3.A
N$18  (via drill 0.6)
  Top 0.508: R2.2 99.06,77.72 99.11,77.72 | 99.11,77.72 SWITCH2.1 | 99.11,77.72 104.9,77.72 106.43,76.33 SWITCH2.19 108.03,76.45 110.24,76.45 111,77.22 v111,78.49 | SELECTOR.3 12.88,49.02 v11.18,49.02
  Bottom 0.508: v11.18,49.02 20.83,49.02 31.75,59.18 31.75,82.55 35.31,86.11 108.71,86.11 111,83.57 v111,78.49
N$19
  Top 0.508: SL3.10 127.51,82.55 arc-90 128.78,81.28 128.78,77.72 arc90 130.05,76.45 130.1,76.45 SWITCH3.2
N$20
  Top 0.508: SL3.9 126.24,80.01 arc-90 127.51,78.74 127.51,75.18 arc90 128.78,73.91 130.1,73.91 SWITCH3.4
N$21
  Top 0.508: SL3.8 124.97,77.47 arc-90 126.24,76.2 126.24,72.64 arc90 127.25,71.37 130.1,71.37 SWITCH3.6
N$22
  Top 0.508: SL3.7 123.44,74.93 arc-90 124.71,73.66 124.71,70.1 arc90 125.98,68.83 130.1,68.83 SWITCH3.8
N$23  (via drill 0.6)
  Top 0.508: SL3.6 122.17,72.39 arc-90 123.44,71.12 123.44,65.79 arc90 124.71,64.52 v130.3,64.52 | v139.19,64.52 arc90 140.46,65.79 140.46,66.12 arc90 SWITCH3.11
  Bottom 0.508: v130.3,64.52 v139.19,64.52
N$24  (via drill 0.6)
  Top 0.508: SL3.5 120.9,69.85 arc-90 122.17,68.58 122.17,64.52 arc90 123.44,63.25 v129.03,63.25 | v141.48,63.25 arc90 142.75,64.52 142.75,67.31 arc90 141.48,68.58 141.17,68.58 SWITCH3.13
  Bottom 0.508: v129.03,63.25 v141.48,63.25
N$25
  Top 0.508: SL3.4 119.63,67.31 arc-90 120.9,66.04 120.9,61.98 arc90 122.17,60.71 D6.A
N$26
  Top 0.508: SL3.3 118.36,64.77 arc-90 119.63,63.5 119.63,59.94 arc90 120.9,58.67 D5.A
N$27  (via drill 0.6)
  Top 0.508: R3.2 131.57,77.72 131.62,77.72 | 131.62,77.72 137.41,77.72 138.94,76.33 SWITCH3.19 141.3,76.45 142.75,76.45 143.51,77.22 v143.51,78.49 | 131.62,77.72 SWITCH3.1 | SELECTOR.2 12.88,50.29 v11.18,50.29
  Bottom 0.508: v11.18,50.29 20.32,50.29 30.48,59.69 30.48,83.31 34.54,87.38 139.19,87.38 143.51,83.57 v143.51,78.49
N$28
  Top 0.508: SL4.10 159.51,82.55 arc-90 160.78,81.28 160.78,77.72 arc90 162.05,76.45 162.61,76.45 SWITCH4.2
N$29
  Top 0.508: SL4.9 158.24,80.01 arc-90 159.51,78.74 159.51,75.18 arc90 160.78,73.91 162.61,73.91 SWITCH4.4
N$30
  Top 0.508: SL4.8 156.97,77.47 arc-90 158.24,76.2 158.24,72.64 arc90 159.51,71.37 162.61,71.37 SWITCH4.6
N$31
  Top 0.508: SL4.7 155.7,74.93 arc-90 156.97,73.66 156.97,70.1 arc90 158.24,68.83 162.61,68.83 SWITCH4.8
N$32  (via drill 0.6)
  Top 0.508: SL4.6 154.43,72.39 arc-90 155.7,71.12 155.7,65.79 arc90 156.97,64.52 v162.81,64.52 | v171.7,64.52 arc90 172.97,65.79 172.97,65.99 SWITCH4.11
  Bottom 0.508: v162.81,64.52 v171.7,64.52
N$33  (via drill 0.6)
  Top 0.508: SL4.5 153.16,69.85 arc-90 154.43,68.58 154.43,64.52 arc90 155.7,63.25 v161.54,63.25 | v173.99,63.25 arc90 175.26,64.52 175.26,67.31 arc90 173.99,68.58 173.81,68.58 SWITCH4.13
  Bottom 0.508: v161.54,63.25 v173.99,63.25
N$34
  Top 0.508: SL4.4 151.89,67.31 arc-90 153.16,66.04 153.16,61.98 arc90 154.43,60.71 D8.A
N$35
  Top 0.508: SL4.3 150.62,64.77 arc-90 151.89,63.5 151.89,59.94 arc90 153.16,58.67 D7.A
N$36  (via drill 0.6)
  Top 0.508: 164.13,77.72 169.93,77.72 171.45,76.33 SWITCH4.19 173.81,76.45 175.26,76.45 176.02,77.22 v176.02,78.49 | 164.13,77.72 164.08,77.72 R4.2 | 164.13,77.72 SWITCH4.1 | SELECTOR.1 14.22,51.69 12.95,51.56 v11.18,51.56
  Bottom 0.508: v11.18,51.56 19.81,51.56 29.21,60.2 29.21,84.07 33.78,88.65 171.2,88.65 176.02,83.57 v176.02,78.49
N$37  (via drill 0.6)
  Top 0.508: SL10.10 SL9.10 | v73.41,73.91 73.41,74.17 arc-90 74.42,75.18 74.88,75.18 SWITCH1.18 | SWITCH2.18 103,75.06 arc90 101.85,73.91 v101.85,54.61 | SWITCH3.18 135.51,75.06 arc90 134.37,73.91 v134.37,54.61 | SWITCH4.18 168.02,75.06 arc90 166.88,73.91 v166.88,54.61 | SWITCH5.18 v76.84,24.26 | v77.72,34.29 v77.72,54.61 | SWITCH6.18 v109.09,24.26 | v110.24,34.29 v110.24,54.61 | SWITCH7.18 v141.86,24.26 | v142.75,34.29 v142.75,54.61 | SWITCH8.18 v174.37,24.26 | v175.26,34.29 v175.26,54.61
  Bottom 0.508: SL9.10 v175.26,54.61 v166.88,54.61 | v166.88,54.61 166.62,54.61 | 166.62,54.61 v142.75,54.61 v134.37,54.61 v110.24,54.61 v101.85,54.61 v77.72,54.61 74.68,54.61 arc-90 73.41,55.88 v73.41,73.91 | v166.88,54.61 166.88,54.86 arc-90 166.62,54.61 | v76.84,24.26 arc90 77.72,25.15 v77.72,34.29 | v109.09,24.26 arc90 110.24,25.4 v110.24,34.29 | v141.86,24.26 arc90 142.75,25.15 v142.75,34.29 | v174.37,24.26 arc90 175.26,25.15 v175.26,34.29
N$38  (via drill 0.6)
  Top 0.508: SL10.9 SL9.9 | v72.14,71.12 72.14,71.37 arc-90 73.41,72.64 74.37,72.64 SWITCH1.16 | SWITCH2.16 104.27,72.52 arc90 103.12,71.37 v103.12,52.07 | SWITCH3.16 136.78,72.52 arc90 135.64,71.37 v135.64,52.07 | SWITCH4.16 169.29,72.52 arc90 168.15,71.37 v168.15,52.07 | SWITCH5.16 74.04,21.72 arc-90 72.9,22.86 v72.9,23.62 | v76.45,32.77 v76.45,52.07 | SWITCH6.16 106.81,21.72 arc-90 105.66,22.86 v105.66,23.62 | v108.97,32.77 v108.97,52.07 | SWITCH7.16 139.32,21.72 arc-90 138.18,22.86 v138.18,23.62 | v141.48,32.77 v141.48,52.07 | SWITCH8.16 171.83,21.72 arc-90 170.69,22.86 v170.69,23.62 | v173.99,32.77 v173.99,52.07
  Bottom 0.508: SL9.9 173.74,52.07 | 173.74,52.07 v168.15,52.07 v141.48,52.07 | v141.48,52.07 v135.64,52.07 108.71,52.07 | 108.71,52.07 v103.12,52.07 v76.45,52.07 73.41,52.07 arc-90 72.14,53.34 v72.14,71.12 | v72.9,23.62 72.9,24.89 arc-90 74.17,26.16 75.18,26.16 arc90 76.45,27.43 v76.45,32.77 | v105.66,23.62 105.66,24.89 arc-90 106.93,26.16 107.7,26.16 arc90 108.97,27.43 v108.97,32.77 | v108.97,52.07 108.97,51.82 arc90 108.71,52.07 | v138.18,23.62 138.18,24.89 arc-90 139.45,26.16 140.21,26.16 arc90 141.48,27.43 v141.48,32.77 | 141.48,51.82 v141.48,52.07 | v170.69,23.62 170.69,24.89 arc-90 171.96,26.16 172.72,26.16 arc90 173.99,27.43 v173.99,32.77 | v173.99,52.07 173.99,51.82 arc90 173.74,52.07
N$39
  Top 0.508: SL13.4 5.84,23.88 7.62,25.65 PIC.11
N$40  (via drill 0.6)
  Top 0.508: v8.13,24.38 PIC.12
  Bottom 0.508: SL13.6 6.35,28.96 7.62,27.69 7.62,24.89 v8.13,24.38
N$41  (via drill 0.6)
  Top 0.508: PIC.13 15.49,23.11 16.51,24.13 v16.51,27.18
  Bottom 0.508: SL13.11 6.1,41.66 6.86,40.89 6.86,38.86 9.65,36.07 16.26,36.07 16.51,35.81 v16.51,27.18
N$42  (via drill 0.6)
  Top 0.508: R10.1 DB_SEL.1 v27.18,12.7 | v25.91,30.73 PIC.22
  Bottom 0.508: v27.18,12.7 25.91,14.22 v25.91,30.73
N$43  (via drill 0.6)
  Top 0.508: PIC.14 v16.51,21.84
  Bottom 0.508: v16.51,21.84 17.53,22.86 17.53,36.58 17.02,37.08 10.16,37.08 7.87,39.37 7.87,42.67 6.35,44.2 SL13.12
N$44
  Top 0.508: SL13.3 6.6,21.34 8.89,19.05 11.1,19.05 CONTRAST.2
N$45
  Top 0.508: SL5.10 62.48,31.75 arc-90 63.75,30.48 63.75,26.92 arc90 65.02,25.65 64.95,25.65 SWITCH5.2
N$46
  Top 0.508: SL5.9 61.21,29.21 arc-90 62.48,27.94 62.48,24.38 arc90 63.75,23.11 65.08,23.11 SWITCH5.4
N$47
  Top 0.508: SL5.8 59.94,26.67 arc-90 61.21,25.4 61.21,21.84 arc90 62.48,20.57 65.08,20.57 SWITCH5.6
N$48
  Top 0.508: SL5.7 58.67,24.13 arc-90 59.94,22.86 59.94,19.3 arc90 61.21,18.03 65.08,18.03 SWITCH5.8
N$49
  Top 0.508: SL5.6 57.4,21.59 arc-90 58.67,20.32 58.67,14.99 arc90 59.94,13.72 74.17,13.72 arc90 75.44,14.99 75.44,15.32 SWITCH5.11
N$50
  Top 0.508: SL5.5 56.13,19.05 arc-90 57.4,17.78 57.4,13.72 arc90 58.67,12.45 76.2,12.45 arc90 77.72,13.72 77.72,16.76 arc90 76.45,18.03 76.15,18.03 SWITCH5.13
N$51
  Top 0.508: SL5.4 55.04,16.51 D10.A
N$52
  Top 0.508: SL5.3 51.56,13.97 arc-90 52.83,12.7 52.83,10.92 arc90 54.1,9.65 D9.A
N$53
  Top 0.508: 66.55,26.67 72.9,26.67 74.04,25.53 SWITCH5.19 76.28,25.65 78.49,25.65 79.5,24.64 79.5,8.38 78.23,7.11 46.23,7.11 44.96,8.38 44.96,48.51 43.05,50.42 SELECTOR.15 | 66.55,26.67 66.47,26.67 SWITCH5.1 | R5.2 66.55,26.67
N$54
  Top 0.508: SL6.10 95,31.75 arc-90 96.27,30.48 96.27,26.92 arc90 97.54,25.65 97.59,25.65 SWITCH6.2
N$55
  Top 0.508: SL6.9 93.73,29.21 arc-90 95,27.94 95,24.38 arc90 96.27,23.11 97.33,23.11 SWITCH6.4
N$56
  Top 0.508: SL6.8 92.46,26.67 arc-90 93.73,25.4 93.73,21.84 arc90 95,20.57 97.59,20.57 SWITCH6.6
N$57
  Top 0.508: SL6.7 91.19,24.13 arc-90 92.46,22.86 92.46,19.3 arc90 93.73,18.03 97.59,18.03 SWITCH6.8
N$58
  Top 0.508: SL6.6 89.92,21.59 arc-90 91.19,20.32 91.19,14.99 arc90 92.46,13.72 106.68,13.72 arc90 107.95,14.99 107.9,15.24 SWITCH6.11
N$59
  Top 0.508: SL6.5 88.65,19.05 arc-90 89.92,17.53 89.92,13.72 arc90 91.19,12.45 108.97,12.45 arc90 110.24,13.72 110.24,16.76 arc90 108.97,18.03 107.9,18.03 SWITCH6.13
N$60
  Top 0.508: SL6.4 87.12,16.51 D12.A
N$61
  Top 0.508: SL6.3 84.07,13.97 arc-90 85.34,12.7 85.34,10.92 arc90 86.61,9.65 D11.A
N$62
  Top 0.508: 99.06,26.92 105.41,26.92 106.55,25.53 SWITCH6.19 108.79,25.65 111,25.65 112.01,24.64 112.01,8.13 109.73,5.84 45.72,5.84 43.69,7.87 43.69,47.5 42.04,49.15 SELECTOR.14 | 99.06,26.92 98.98,26.92 SWITCH6.1 | R6.2 99.06,26.92
N$63
  Top 0.508: SL7.10 127.51,31.75 arc-90 128.78,30.48 128.78,26.92 arc90 130.05,25.65 130.1,25.65 SWITCH7.2
N$64
  Top 0.508: SL7.9 126.24,29.21 arc-90 127.51,27.94 127.51,24.38 arc90 128.78,23.11 130.1,23.11 SWITCH7.4
N$65
  Top 0.508: SL7.8 124.97,26.67 arc-90 126.24,25.4 126.24,21.84 arc90 127.51,20.57 130.1,20.57 SWITCH7.6
N$66
  Top 0.508: SL7.7 123.7,24.13 arc-90 124.97,22.86 124.97,19.3 arc90 126.24,18.03 130.1,18.03 SWITCH7.8
N$67
  Top 0.508: SL7.6 122.43,21.59 arc-90 123.7,20.32 123.7,14.99 arc90 124.97,13.72 139.19,13.72 arc90 140.46,14.99 140.46,15.32 arc90 SWITCH7.11
N$68
  Top 0.508: SL7.5 121.16,19.05 arc-90 122.43,17.78 122.43,13.72 arc90 123.7,12.45 141.22,12.45 arc90 142.49,13.72 142.49,16.51 arc90 141.22,17.78 141.17,17.78 SWITCH7.13
N$69
  Top 0.508: SL7.4 120.07,16.51 arc-90 D14.A
N$70
  Top 0.508: SL7.3 116.59,13.97 arc-90 117.86,12.7 117.86,10.92 arc90 119.13,9.65 D13.A
N$71
  Top 0.508: 131.57,26.92 137.92,26.92 139.06,25.53 SWITCH7.19 141.3,25.65 143.51,25.65 144.53,24.64 144.53,8.13 141.48,4.57 45.21,4.57 42.42,7.37 42.42,46.74 41.27,47.88 SELECTOR.13 | 131.57,26.92 131.5,26.92 SWITCH7.1 | R7.2 131.57,26.92
N$72
  Top 0.508: SL8.10 160.02,31.75 arc-90 161.29,30.48 161.29,26.92 arc90 162.56,25.65 162.61,25.65 SWITCH8.2
N$73
  Top 0.508: SL8.9 158.75,29.21 arc-90 160.02,27.94 160.02,24.38 arc90 161.29,23.11 162.61,23.11 SWITCH8.4
N$74
  Top 0.508: SL8.8 157.48,26.67 arc-90 158.75,25.4 158.75,21.84 arc90 160.02,20.57 162.61,20.57 SWITCH8.6
N$75
  Top 0.508: SL8.7 156.21,24.13 arc-90 157.48,22.86 157.48,19.3 arc90 158.75,18.03 162.61,18.03 SWITCH8.8
N$76
  Top 0.508: SL8.6 154.94,21.59 arc-90 156.21,20.32 156.21,14.99 arc90 157.48,13.72 171.7,13.72 arc90 172.97,14.99 172.92,15.24 SWITCH8.11
N$77
  Top 0.508: SL8.5 153.67,19.05 arc-90 154.94,17.78 154.94,13.72 arc90 156.21,12.45 173.74,12.45 arc90 175.01,13.72 175.01,16.76 arc90 173.74,18.03 173.69,18.03 SWITCH8.13
N$78
  Top 0.508: SL8.4 152.58,16.51 D16.A
N$79
  Top 0.508: SL8.3 149.1,13.97 arc-90 150.37,12.7 150.37,10.92 arc90 151.64,9.65 D15.A
N$80
  Top 0.508: 164.08,26.92 170.43,26.92 171.58,25.53 SWITCH8.19 173.81,25.65 176.02,25.65 177.04,24.64 177.04,6.35 174.75,3.3 44.7,3.3 41.15,6.86 41.15,45.97 40.51,46.61 SELECTOR.12 | 164.08,26.92 164.01,26.92 SWITCH8.1 | R8.2 164.08,26.92
N$81  (via drill 0.6)
  Top 0.508: R11.1 DB_SEL.2 v24.64,12.7 | v24.64,32 PIC.23
  Bottom 0.508: v24.64,12.7 v24.64,32
N$82  (via drill 0.6)
  Top 0.508: R9.2 8.89,39.37 9.91,38.35 | 9.91,38.35 PIC.1 | 1-MCLR.TP v34.04,38.86 | v20.57,35.81 19.05,35.81 16.51,33.27 v15.24,33.27 | v10.16,34.54 9.91,34.8 9.91,38.35
  Bottom 0.508: v34.04,38.86 29.21,38.86 26.42,35.81 v20.57,35.81 | v15.24,33.27 14.22,34.54 v10.16,34.54
N$83
  Top 0.508: PIC.5 8.89,33.27 7.11,35.05 7.11,43.85 R16.2 9.06,45.47 9.91,45.47 11.3,44.07 SELECTOR.7
N$84
  Top 0.635: USB.SHIELD1 2.54,68.83 C11.1 R18.1
  Top 1.499: USB.SHIELD2 USB.SHIELD1
N$85  (via drill 0.6)
  Top 0.508: PIC.4 16.26,34.54 17.27,35.56 17.27,44.2 18.29,45.21 20.4,45.21 SELECTOR.11 22.61,45.47 v39.12,45.47
  Bottom 0.508: v39.12,45.47 43.94,45.47 44.96,44.2 44.96,8.38 46.23,7.11 178.82,7.11 180.85,9.4 180.85,16 182.63,17.53 SL11.5
N$86  (via drill 0.6)
  Top 0.508: PIC.3 15.75,35.81 16.26,36.32 v16.26,41.4 | v18.8,43.94 20.4,43.94 SELECTOR.10 22.61,44.2 v37.85,44.2 | v179.83,5.84 182.37,8.89 v182.37,18.8
  Bottom 0.508: v16.26,41.4 16.26,43.18 17.02,43.94 v18.8,43.94 | v37.85,44.2 42.67,44.2 43.69,42.93 43.69,7.87 45.72,5.84 v179.83,5.84 | v182.37,18.8 183.64,20.07 SL11.6
N$87  (via drill 0.6)
  Top 0.508: PIC.2 14.99,37.08 15.24,37.34 v15.24,40.13 | v19.56,42.67 20.4,42.67 SELECTOR.9 22.61,42.93 v39.12,42.93 | v178.56,4.57 180.85,4.57 183.9,8.38 v183.9,21.34
  Bottom 0.508: v15.24,40.13 17.53,40.13 18.54,41.15 18.54,42.16 19.05,42.67 v19.56,42.67 | v39.12,42.93 41.4,42.93 42.42,41.66 42.42,7.37 45.21,4.57 v178.56,4.57 | v183.9,21.34 185.17,22.61 SL11.7
N$88  (via drill 0.6)
  Top 0.508: PIC.6 14.78,31.75 16.51,31.75 19.56,34.54 v20.57,34.54
  Bottom 0.508: v20.57,34.54 40.13,34.54 41.15,33.53 41.15,6.86 44.7,3.3 180.85,3.3 184.66,8.13 184.66,12.95 186.69,14.99 SL11.4
N$89
  Top 0.508: PIC.28 26.42,38.35 27.43,39.37 4-DAT.TP
N$90
  Top 0.508: PIC.27 21.34,37.08 20.57,37.85 20.57,39.37 21.59,40.39 5-CLK.TP
N$91  (via drill 0.6)
  Top 0.508: PIC.7 14.78,30.48 17.02,30.48 20.07,33.27 v20.57,33.27
  Bottom 0.508: v20.57,33.27 38.86,33.27 39.88,32.26 39.88,6.35 44.2,2.03 182.12,2.03 186.18,7.37 186.18,11.18 187.45,12.45 SL11.3
N$92
  Top 0.508: SL13.16 6.94,54.36 Q1.3
N$93
  Top 0.508: Q1.1 12.27,57.74 R17.1
N$94
  Top 0.406: USB.VBUS1 9.4,64.8 D17.A
N$95  (via drill 0.6)
  Top 0.508: v27.18,29.46 PIC.21
  Bottom 0.508: SL14.1 19.81,6.86 22.61,9.65 27.69,9.65 28.7,10.67 28.7,13.72 27.18,15.49 v27.18,29.46
N$96  (via drill 0.6)
  Top 0.508: PIC.15 v19.81,21.84
  Bottom 0.508: v19.81,21.84 18.54,22.86 18.54,37.34 17.78,38.1 10.67,38.1 8.89,39.88 8.89,45.21 7.11,46.74 SL13.13
N$97  (via drill 0.6)
  Top 0.508: PIC.16 v20.57,23.11
  Bottom 0.508: v20.57,23.11 19.56,23.62 19.56,38.1 18.8,38.86 11.18,39.12 9.91,40.39 9.91,47.24 7.62,49.28 SL13.14
N$98  (via drill 0.6)
  Top 0.508: R17.2 v15.75,57.66 | v20.83,57.66 25.4,57.66 28.96,53.85 34.8,53.85 v36.58,52.07 | v34.29,37.08 v34.29,32 | v29.72,24.38 PIC.17
  Bottom 0.508: v15.75,57.66 v20.83,57.66 | v36.58,52.07 36.58,38.61 v34.29,37.08 | v34.29,32 33.53,30.73 30.99,30.73 29.72,28.96 v29.72,24.38
N$99
  Top 0.406: C13.+ 18.54,76.45
  Top 1.194: D18.C 20.83,81.79 20.83,80.26 18.54,78.74 18.54,76.45 18.54,74.42 13.18,71.88 IC1.3
N$100  (via drill 0.6)
  Top 0.508: SL12.1 R15.1 | v14.99,26.92 PIC.10
  Bottom 0.508: SL12.1 7.62,6.86 9.4,8.89 9.4,17.27 11.94,19.56 14.48,19.56 15.49,20.83 15.49,26.42 v14.99,26.92
N$101  (via drill 0.6)
  Top 0.508: SL12.3 R14.1 | v9.65,27.18 10.67,28.19 PIC.9
  Bottom 0.508: SL12.3 4.83,11.94 6.86,13.97 6.86,19.56 8.38,21.08 8.89,21.08 9.65,22.35 v9.65,27.18
N$102  (via drill 0.6)
  Top 0.406: R19.1 67.82,52.07 66.8,53.09 v64.52,53.09
  Top 0.508: SL10.3 SL9.3 | v64.52,57.66 64.52,58.49 D1.C | D3.C 96.77,57.91 v96.77,36.83 | D5.C 129.29,57.91 v129.29,36.83 | D7.C 161.8,57.91 v161.8,36.83 | D9.C 58.42,9.65 v58.42,11.18 | D11.C 90.93,9.91 v90.93,11.18 | D13.C 123.44,9.65 v123.44,11.18 | D15.C 155.96,9.65 v155.96,11.18
  Bottom 0.508: SL9.3 v161.8,36.83 155.7,36.83 | 155.7,36.83 v129.29,36.83 123.19,36.83 | 123.19,36.83 v96.77,36.83 90.42,36.83 | 90.42,36.83 68.58,36.83 | 68.58,36.83 65.79,36.83 arc-90 64.52,38.1 v64.52,53.09 v64.52,57.66 | v58.42,11.18 58.42,33.53 arc-90 59.69,34.8 67.31,34.8 arc90 68.58,36.07 68.58,36.83 | v90.93,11.18 90.93,36.58 90.42,36.83 | v123.44,11.18 123.44,36.58 123.19,36.83 | v155.96,11.18 155.96,36.58 155.7,36.83
N$103  (via drill 0.6)
  Top 0.406: R12.1 63.25,37.59 62.74,37.08 v62.74,36.07
  Top 0.508: SL10.4 SL9.4 | v65.79,60.45 arc90 65.02,61.21 D2.C | D4.C 96.77,60.71 arc-90 98.04,59.44 v98.04,39.37 | D6.C 129.54,60.71 arc-90 130.56,59.69 v130.56,39.37 | D8.C 161.8,60.71 arc-90 163.07,59.44 v163.07,39.37 | D10.C v55.12,11.94 | D12.C v87.63,11.94 | v89.66,35.31 v89.66,39.37 | D14.C v120.14,11.94 | v121.92,35.31 v121.92,39.37 | D16.C v152.65,11.94 | v154.69,35.31 v154.69,39.37 | v62.74,36.07 65.79,36.07 arc90 67.06,37.34 v67.06,39.37
  Bottom 0.508: SL9.4 v163.07,39.37 154.94,39.37 | 154.94,39.37 v130.56,39.37 122.17,39.37 | 122.17,39.37 v98.04,39.37 v89.66,39.37 v67.06,39.37 arc-90 65.79,40.64 v65.79,60.45 | v55.12,11.94 arc180 57.15,11.94 57.15,34.8 arc-90 58.42,36.07 v62.74,36.07 | v87.63,11.94 arc180 89.66,11.94 v89.66,35.31 | v120.14,11.94 arc180 122.17,11.94 v121.92,35.31 | v121.92,39.37 121.92,39.12 122.17,39.37 | v152.65,11.94 arc180 154.69,11.94 v154.69,35.31 | v154.69,39.37 154.69,39.12 154.94,39.37
N$104  (via drill 0.6)
  Top 0.508: SL10.5 SL9.5 | v64.01,70.1 65.08,70.1 SWITCH1.7 | SWITCH2.7 98.3,69.98 97.54,70.1 v96.52,70.1 | v97.79,61.98 arc-90 99.31,60.71 v99.31,41.91 | SWITCH3.7 130.81,69.98 130.05,70.1 v128.78,70.1 | v130.3,61.98 130.56,61.98 arc-90 131.83,60.71 v131.83,41.91 | SWITCH4.7 162.56,70.1 v161.54,70.1 | v162.81,61.98 163.07,61.98 arc-90 164.34,60.71 v164.34,41.91 | SWITCH5.7 66.93,19.18 arc90 67.82,20.32 v67.82,23.62 | v71.37,32.77 v71.37,41.91 | SWITCH6.7 99.44,19.18 arc90 100.58,20.32 v100.58,23.37 | v103.89,32.77 v103.89,41.91 | SWITCH7.7 131.95,19.18 arc90 133.1,20.32 v133.1,23.62 | v136.4,32.77 v136.4,41.91 | SWITCH8.7 164.72,19.18 arc90 165.61,20.07 v165.61,23.62 | v168.91,32.77 v168.91,40.64
  Bottom 0.508: SL9.5 168.91,41.91 | 168.91,41.91 v164.34,41.91 v136.4,41.91 v131.83,41.91 104.14,41.91 | 104.14,41.91 v103.89,41.91 | v103.89,41.91 v99.31,41.91 v71.37,41.91 68.33,41.91 arc-90 67.06,43.18 67.06,62.48 arc90 65.79,63.75 64.52,63.75 arc-90 63.25,65.02 63.25,69.09 arc-90 v64.01,70.1 | v96.52,70.1 96.27,70.1 arc90 95.25,68.58 95.25,63.25 arc90 96.27,61.98 v97.79,61.98 | v128.78,70.1 arc90 127.76,69.09 127.76,62.99 arc90 128.78,61.98 v130.3,61.98 | v161.54,70.1 161.04,70.1 arc90 159.77,68.83 159.77,63.25 arc90 161.04,61.98 v162.81,61.98 | v67.82,23.62 67.82,29.72 arc-90 69.09,30.99 70.1,30.99 arc90 71.37,32.26 v71.37,32.77 | v100.58,23.37 100.58,29.97 arc-90 101.85,31.24 102.62,31.24 arc90 103.89,32.51 v103.89,32.77 | v103.89,41.91 103.89,41.66 arc-90 104.14,41.91 | v133.1,23.62 133.1,29.72 arc-90 134.37,30.99 135.13,30.99 arc90 136.4,32.26 v136.4,32.77 | v165.61,23.62 165.61,29.97 arc-90 167.13,31.5 168.15,31.5 arc90 168.91,32.26 v168.91,32.77 | v168.91,40.64 168.91,41.91
N$105  (via drill 0.6)
  Top 0.508: SL10.6 SL9.6 | v68.33,66.04 68.33,66.29 arc90 67.31,67.56 67.11,67.56 SWITCH1.9 | SWITCH2.9 99.44,67.44 arc-90 100.58,66.29 v100.58,44.45 | SWITCH3.9 131.95,67.44 arc-90 133.1,66.29 v133.1,44.45 | SWITCH4.9 164.47,67.44 arc-90 165.61,66.29 v165.61,44.45 | SWITCH5.9 67.95,16.64 arc90 69.09,17.78 v69.09,22.35 | v72.64,34.29 v72.64,44.45 | SWITCH6.9 100.71,16.64 arc90 101.85,17.78 v101.85,22.1 | v105.16,34.29 v105.16,44.45 | SWITCH7.9 133.22,16.64 arc90 134.37,17.78 v134.37,22.35 | v137.67,34.29 v137.67,44.45 | SWITCH8.9 165.73,16.64 arc90 166.88,17.78 v166.88,22.35 | v170.18,34.29 v170.18,44.45
  Bottom 0.508: SL9.6 v170.18,44.45 | v170.18,44.45 169.93,44.45 | 169.93,44.45 v165.61,44.45 v137.67,44.45 v133.1,44.45 v105.16,44.45 v100.58,44.45 72.9,44.45 | 72.9,44.45 v72.64,44.45 | v72.64,44.45 69.6,44.45 arc-90 68.33,45.72 v68.33,66.04 | v69.09,22.35 69.09,28.7 arc-90 70.36,29.97 71.37,29.97 arc90 72.64,31.24 v72.64,34.29 | v72.64,44.45 72.64,44.2 arc-90 72.9,44.45 | v101.85,22.1 101.85,28.7 arc-90 103.12,29.97 103.89,29.97 arc90 105.16,31.24 v105.16,34.29 | v134.37,22.35 134.37,28.7 arc-90 135.64,29.97 136.4,29.97 arc90 137.67,31.24 v137.67,34.29 | v166.88,22.35 166.88,28.96 arc-90 168.15,30.23 168.91,30.23 arc90 170.18,31.5 v170.18,34.29 | v170.18,44.45 170.18,44.2 arc90 169.93,44.45
N$106  (via drill 0.6)
  Top 0.508: SL10.7 SL9.7 | v69.6,66.04 69.6,66.29 arc-90 70.87,67.56 74.62,67.56 SWITCH1.12 | SWITCH2.12 106.81,67.44 arc90 105.66,66.29 v105.66,46.99 arc-90 106.43,46.23 v106.43,32.77 | SWITCH3.12 139.32,67.44 arc90 138.18,66.29 v138.18,46.99 arc-90 138.94,46.23 v138.94,32.77 | SWITCH4.12 171.83,67.44 arc90 170.69,66.29 v170.69,46.99 arc-90 171.45,46.23 v171.45,32.77 | SWITCH5.12 72.26,16.64 arc-90 70.36,18.54 v70.36,23.62 | v73.91,32.77 v73.91,46.99 | SWITCH6.12 104.27,16.64 arc-90 103.12,17.78 v103.12,23.37 | SWITCH7.12 136.52,16.64 arc-90 135.64,17.53 v135.64,23.62 | SWITCH8.12 169.29,16.64 arc-90 168.15,17.78 v168.15,23.62
  Bottom 0.508: SL9.7 v170.69,46.99 v138.18,46.99 v105.66,46.99 74.17,46.99 | 74.17,46.99 v73.91,46.99 | v73.91,46.99 70.87,46.99 arc-90 69.6,48.26 v69.6,66.04 | v70.36,23.62 70.36,27.43 arc-90 71.63,28.7 72.64,28.7 arc90 73.91,29.97 v73.91,32.77 | v73.91,46.99 73.91,46.74 arc-90 74.17,46.99 | v103.12,23.37 103.12,27.43 arc-90 104.39,28.7 105.16,28.7 arc90 106.43,29.97 v106.43,32.77 | v135.64,23.62 135.64,27.43 arc-90 136.91,28.7 137.67,28.7 arc90 138.94,29.97 v138.94,32.77 | v168.15,23.62 168.15,27.69 arc-90 169.42,28.96 170.18,28.96 arc90 171.45,30.23 v171.45,32.77
N$107  (via drill 0.6)
  Top 0.508: SL10.8 SL9.8 | v70.87,68.58 arc-90 72.14,69.85 74.62,69.85 SWITCH1.14 | SWITCH2.14 105.54,69.98 arc90 104.39,68.83 v104.39,49.53 | SWITCH3.14 138.05,69.98 arc90 136.91,68.83 v136.91,49.53 | SWITCH4.14 170.56,69.98 arc90 169.42,68.83 v169.42,49.53 | SWITCH5.14 72.77,19.18 arc-90 71.63,20.32 v71.63,22.35 | v75.18,31.24 v75.18,49.53 | SWITCH6.14 105.54,19.18 arc-90 104.39,20.32 v104.39,22.1 | v107.7,31.24 v107.7,49.53 | SWITCH7.14 138.05,19.18 arc-90 136.91,20.32 v136.91,22.35 | v140.21,31.24 v140.21,49.53 | SWITCH8.14 170.81,19.18 arc-90 169.42,20.32 v169.42,22.35 | v172.72,31.5 v172.72,49.53
  Bottom 0.508: SL9.8 v172.72,49.53 v169.42,49.53 v140.21,49.53 v136.91,49.53 107.95,49.53 | 107.95,49.53 v107.7,49.53 | v107.7,49.53 v104.39,49.53 74.93,49.53 | 74.93,49.53 72.14,49.53 arc-90 70.87,50.8 v70.87,68.58 | v71.63,22.35 71.63,26.16 arc-90 72.9,27.43 73.91,27.43 arc90 75.18,28.7 v75.18,31.24 | v75.18,49.53 75.18,49.28 arc90 74.93,49.53 | v104.39,22.1 104.39,26.16 arc-90 105.66,27.43 106.43,27.43 arc90 107.7,28.7 v107.7,31.24 | v107.7,49.53 107.7,49.28 arc-90 107.95,49.53 | v136.91,22.35 136.91,26.16 arc-90 138.18,27.43 138.94,27.43 arc90 140.21,28.7 v140.21,31.24 | v169.42,22.35 169.42,26.16 arc-90 170.69,27.43 171.45,27.43 arc90 172.72,28.7 v172.72,31.5
N$108
  Top 1.194: D18.A J1.PWR
N$109
  Top 0.381: USB.D-1 7.99,64.15 8.38,63.75 10.67,63.75 11.18,63.25 D-.TP
N$110
  Top 0.381: USB.D+1 7.62,63.5 8.13,62.99 9.14,62.99 9.4,62.74 D+.TP
N$111
  Top 0.381: USB.ID1 7,62.85 ID.TP
N$112
  Top 0.406: R12.2 R13.1
N$113
  Top 0.406: R20.1 R19.2
N$116  (via drill 0.6)
  Top 0.508: PIC.25 27.94,34.54 31.75,30.73 38.1,30.73 39.88,28.96 39.88,6.35 44.2,2.03 180.85,2.03 185.42,7.87 v185.42,23.88
  Bottom 0.508: v185.42,23.88 186.69,25.15 SL11.8
N$117  (via drill 0.6)
  Top 0.508: PIC.24 27.18,33.27 30.99,29.46 37.34,29.46 38.61,28.19 38.61,5.84 43.69,0.76 182.37,0.76 186.94,6.86 v186.94,26.42
  Bottom 0.508: v186.94,26.42 188.21,27.69 SL11.9
VCC  (via drill 0.6, 0.8)
  Top 0.508: R1.1 71.21,82.38 C1.1 72.85,81.28 SWITCH1.20 74.55,77.6 | SWITCH2.20 105.36,81.28 C2.1 103.72,82.38 R2.1 99.73,83.65 99.73,84.75 100.08,84.84 | SWITCH3.20 137.92,81.28 C3.1 136.23,82.38 R3.1 132.25,83.65 132.25,84.49 132.33,84.84 | SWITCH4.20 172.72,77.85 170.43,81.28 C4.1 168.74,82.38 R4.1 164.85,83.82 164.85,84.84 | R1.1 66.46,82.38 | 23.14,64.77 C12.+ | SL13.2 5.59,18.8 8.64,15.75 9.8,15.75 CONTRAST.1 9.93,16.53 10.92,17.53 13.21,17.53 14.22,18.54 C10.1 18.03,20.79 18.03,22.86 20.32,25.15 v20.57,25.15 | C9.1 20.07,55.12 20.57,54.61 20.57,52.32 21.21,51.69 SELECTOR.16 19.99,51.69 18.54,50.55 v18.54,46.48 | 75.39,26.92 72.64,30.48 C5.1 71.72,29.81 70.87,28.96 69.09,28.96 68.33,29.72 68.33,30.73 67.56,31.5 66.64,31.5 R5.1 66.46,31.58 64.77,33.27 58.42,33.27 57.4,34.29 49.78,34.29 48.51,35.56 v48.51,50.55 | 75.39,26.92 SWITCH5.20 | DB_SEL.3 24.64,9.91 22.61,11.94 15.79,11.94 SL14.3 | C9.1 18.88,60.2 | 18.88,60.2 18.88,63.41 18.54,63.5 | C9.1 18.88,53.76 18.31,52.83 v17.65,52.83 | v8.89,50.8 R16.1 9.56,47.33 v10.92,45.97 | 107.95,27 105.16,30.48 C6.1 104.23,29.81 103.38,28.96 101.6,28.96 100.84,29.72 100.84,30.73 100.08,31.5 99.15,31.5 R6.1 97.12,33.53 79.25,33.53 77.72,32 77.72,28.45 76.2,26.92 75.39,26.92 | 107.95,27 SWITCH6.20 | SWITCH7.20 140.41,26.98 | 140.41,26.98 137.67,30.48 C7.1 136.74,29.81 136.14,28.96 134.11,28.96 133.35,29.72 133.35,30.99 132.59,31.5 131.66,31.5 R7.1 129.63,33.53 111.76,33.53 110.24,32 110.24,28.45 108.79,27 107.95,27 | SWITCH8.20 172.92,26.98 170.18,30.48 C8.1 169.25,29.81 168.66,28.96 166.62,28.96 165.86,29.72 165.86,30.99 165.1,31.75 164.25,31.75 R8.1 162.14,33.53 144.27,33.53 142.75,32 142.75,28.45 141.27,26.98 140.41,26.98
  Top 0.508: R9.1 9.06,42.93 v10.92,42.93 | v20.57,27.94 20.83,28.19 PIC.20 v28.45,28.19 | v32.51,41.66 2-VCC.TP v32.51,32 | v44.96,53.59 37.34,53.59 35.56,55.37 29.72,55.37 26.16,59.18 19.9,59.18 18.88,60.2 | 67.31,84.84 67.31,83.65 R1.1
  Top 0.635: D17.C 10.92,68 12.45,65.79 15.49,65.79
  Top 1.016: DB_SEL.4 DB_SEL.3
  Top 1.194: C12.+ 21.59,63.5 18.54,63.5 15.49,63.5 | IC1.2 15.49,65.79 15.49,63.5 | 15.49,63.5 IC1.TAB
  Top 1.27: 23.14,64.77 24.38,64.77 25.65,66.04 25.65,81.03 29.46,84.84 67.31,84.84 100.08,84.84 132.33,84.84 164.85,84.84 185.17,84.84 189.99,79.25 v189.99,75.69 | 15.79,11.94 C10.1 | SL11.1 192.79,7.37 189.99,10.16 v189.99,28.96
  Bottom 0.508: SL12.2 2.29,9.4 1.02,10.67 1.02,17.53 2.29,18.8 SL13.2 | v17.65,52.83 10.41,52.83 v8.89,50.8 6.86,50.8 5.84,51.82 SL13.15 | v10.92,42.93 v10.92,45.97 | v20.57,25.15 v20.57,27.94 | v18.54,46.48 22.61,44.2 22.61,42.67 23.62,41.66 v32.51,41.66 | v48.51,50.55 48.51,52.83 47.75,53.59 v44.96,53.59 | v28.45,28.19 28.45,29.97 29.97,32 v32.51,32
  Bottom 1.27: v189.99,28.96 v189.99,75.69

### Text on the board
tNames: VIDEO SWITCH / MOD: JL-1701 - REV: 1.1 | 1 | 1 | 1 | 1 | IN/OUT PINS / 10-AUDIO L / 09-AUDIO R / 08-CVBS / 07-RED / 06-GREEN / 05-BLUE / 04-ASPECT / 03-BLANKING / 02-GND / 01-GND | 1 | + | 1 | 1 | 1 | 1 | SIG.